# EasyEDA schematic SCH_3.0-CONTROLADORA-PARA-PS2_2024-07-29.json

## Sheets
1 STM32 BLUEPILL copy: TITLE: STM32F103C8T6 BLUEPILL; REV: 1.0; Date: 2021-10-12; Sheet: 1/1; Drawn By: Marlon Vinicius; Company: Your Company
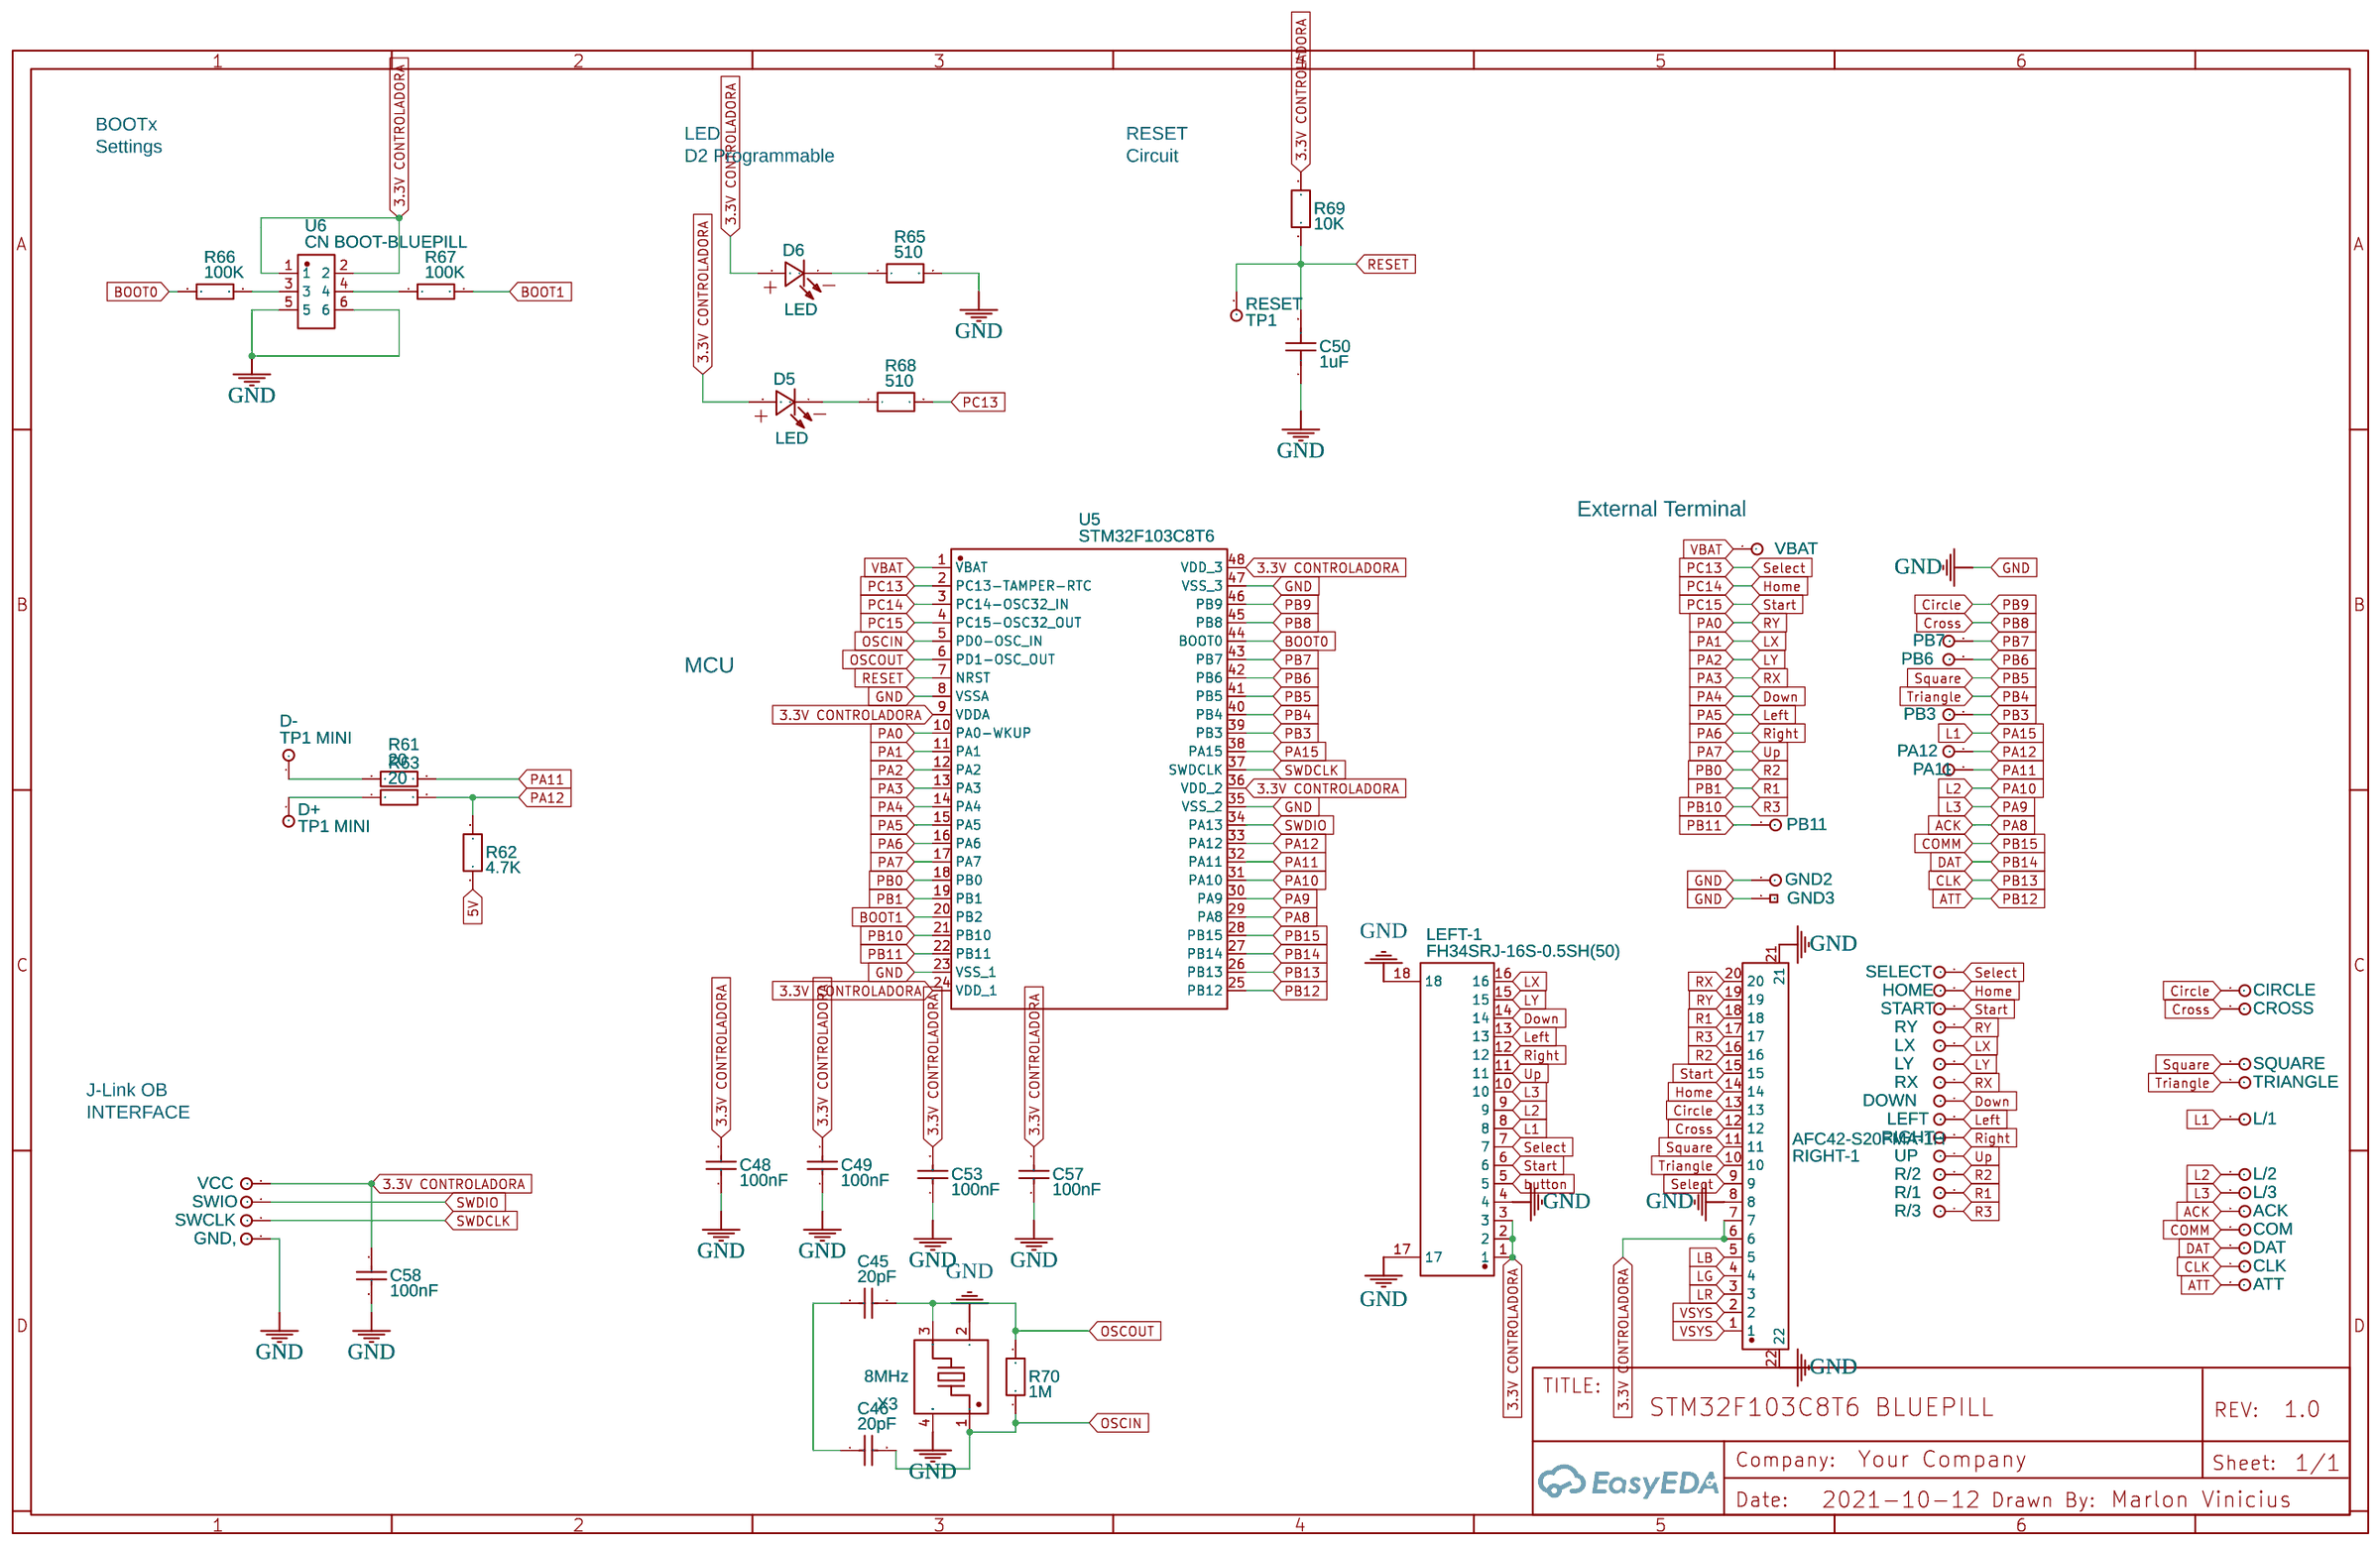
[diagram p0: STM32 BLUEPILL copy]
2 Controladora copy: TITLE: PCB800099; Date: 2021-08-18; Company: PORTABILIZA BR
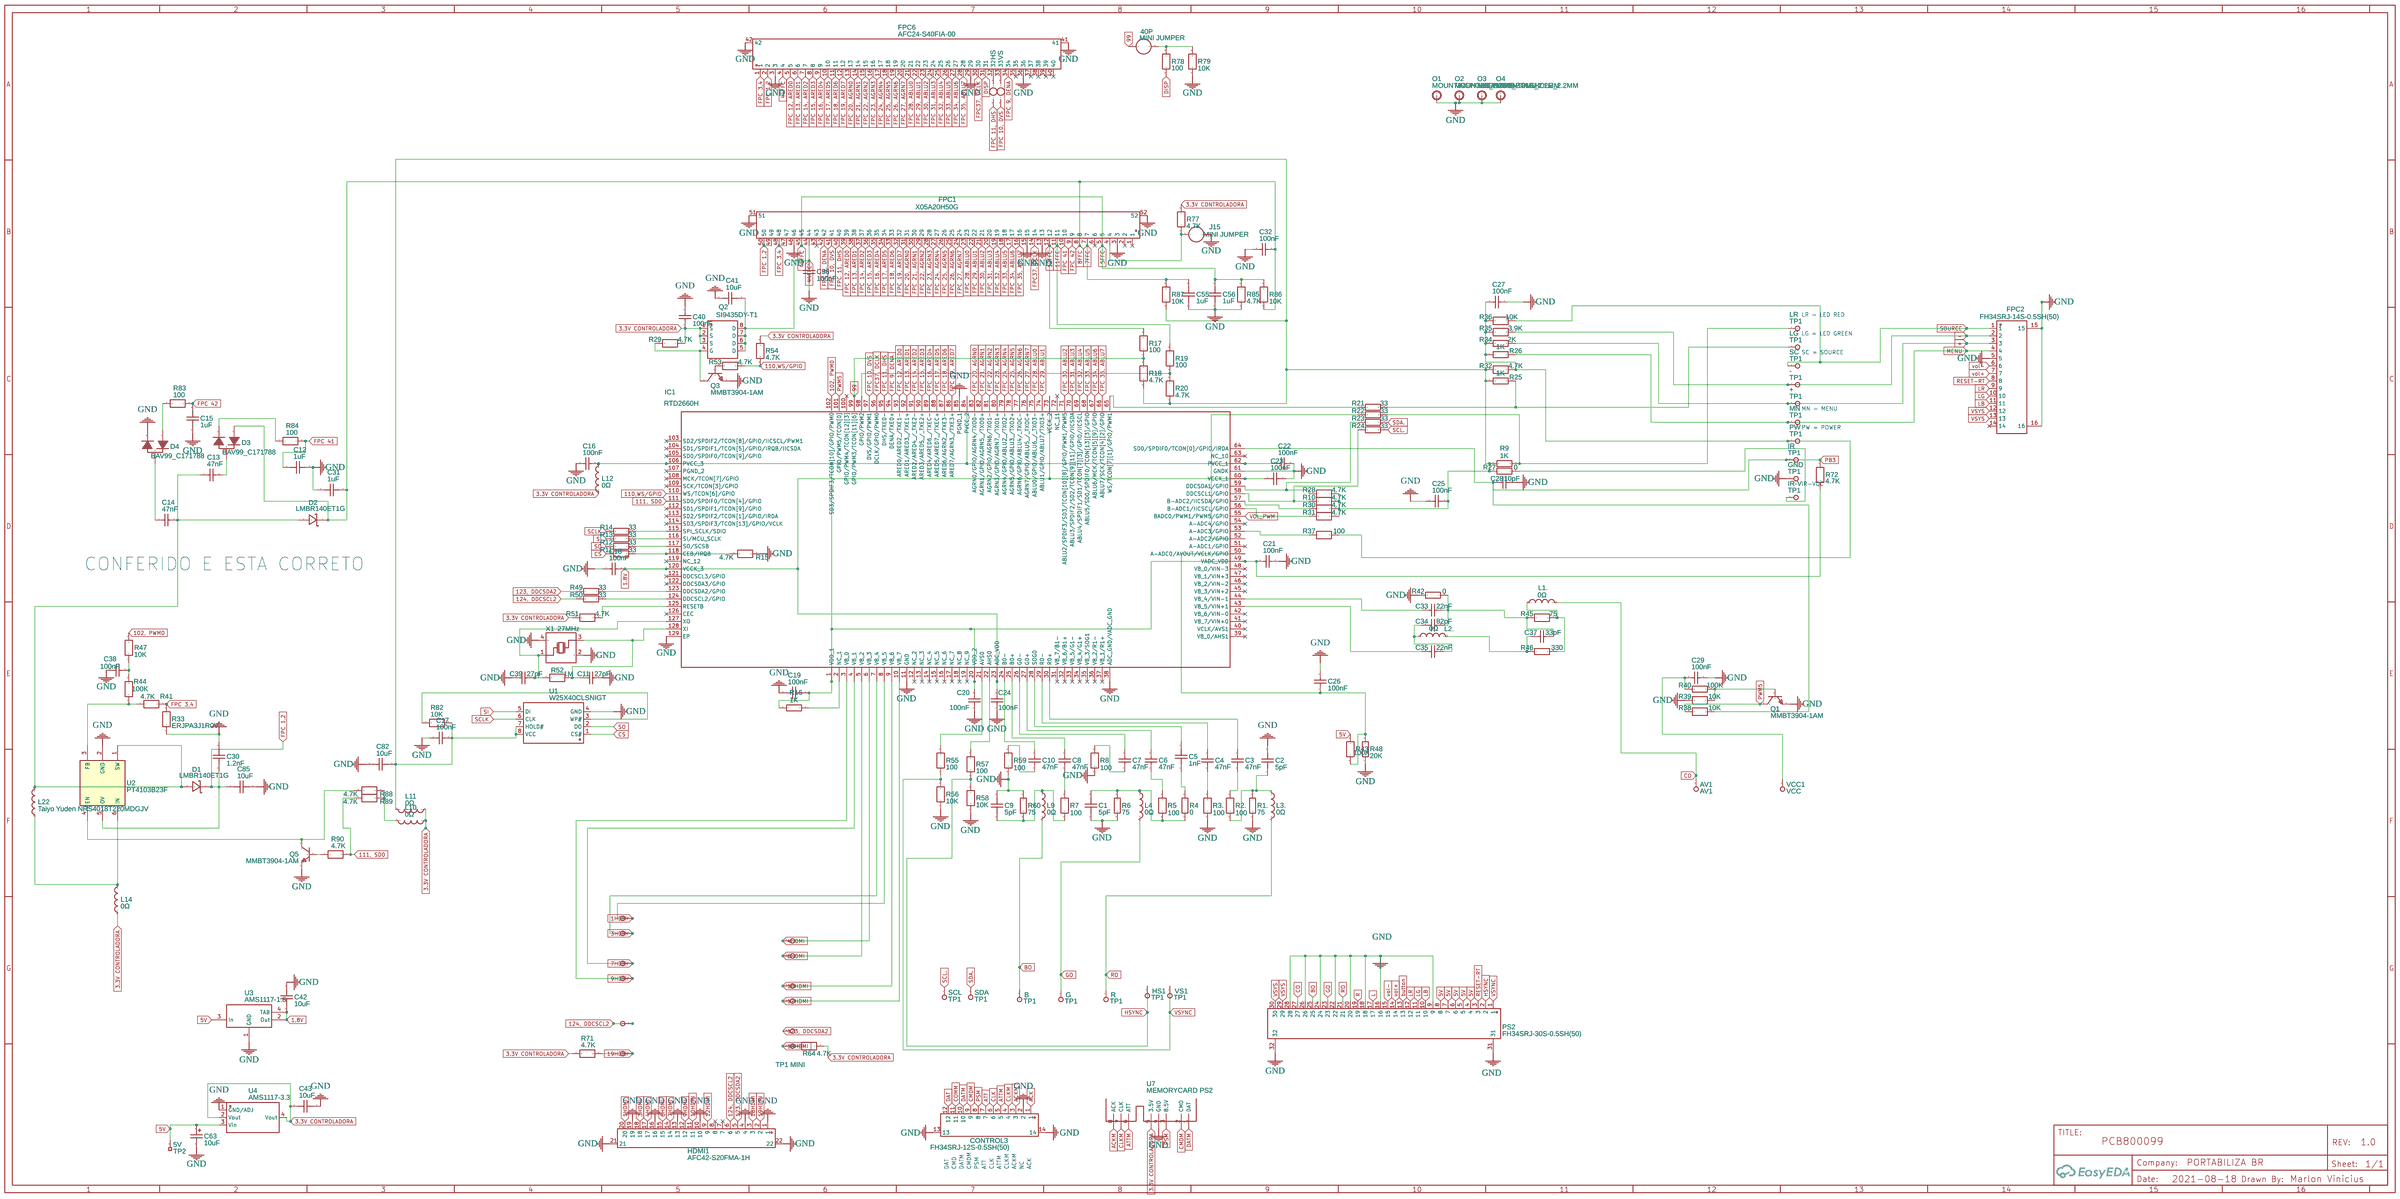
[diagram p1: Controladora copy]
3 AUDIO: TITLE: Sheet_1; Date: 2022-05-21
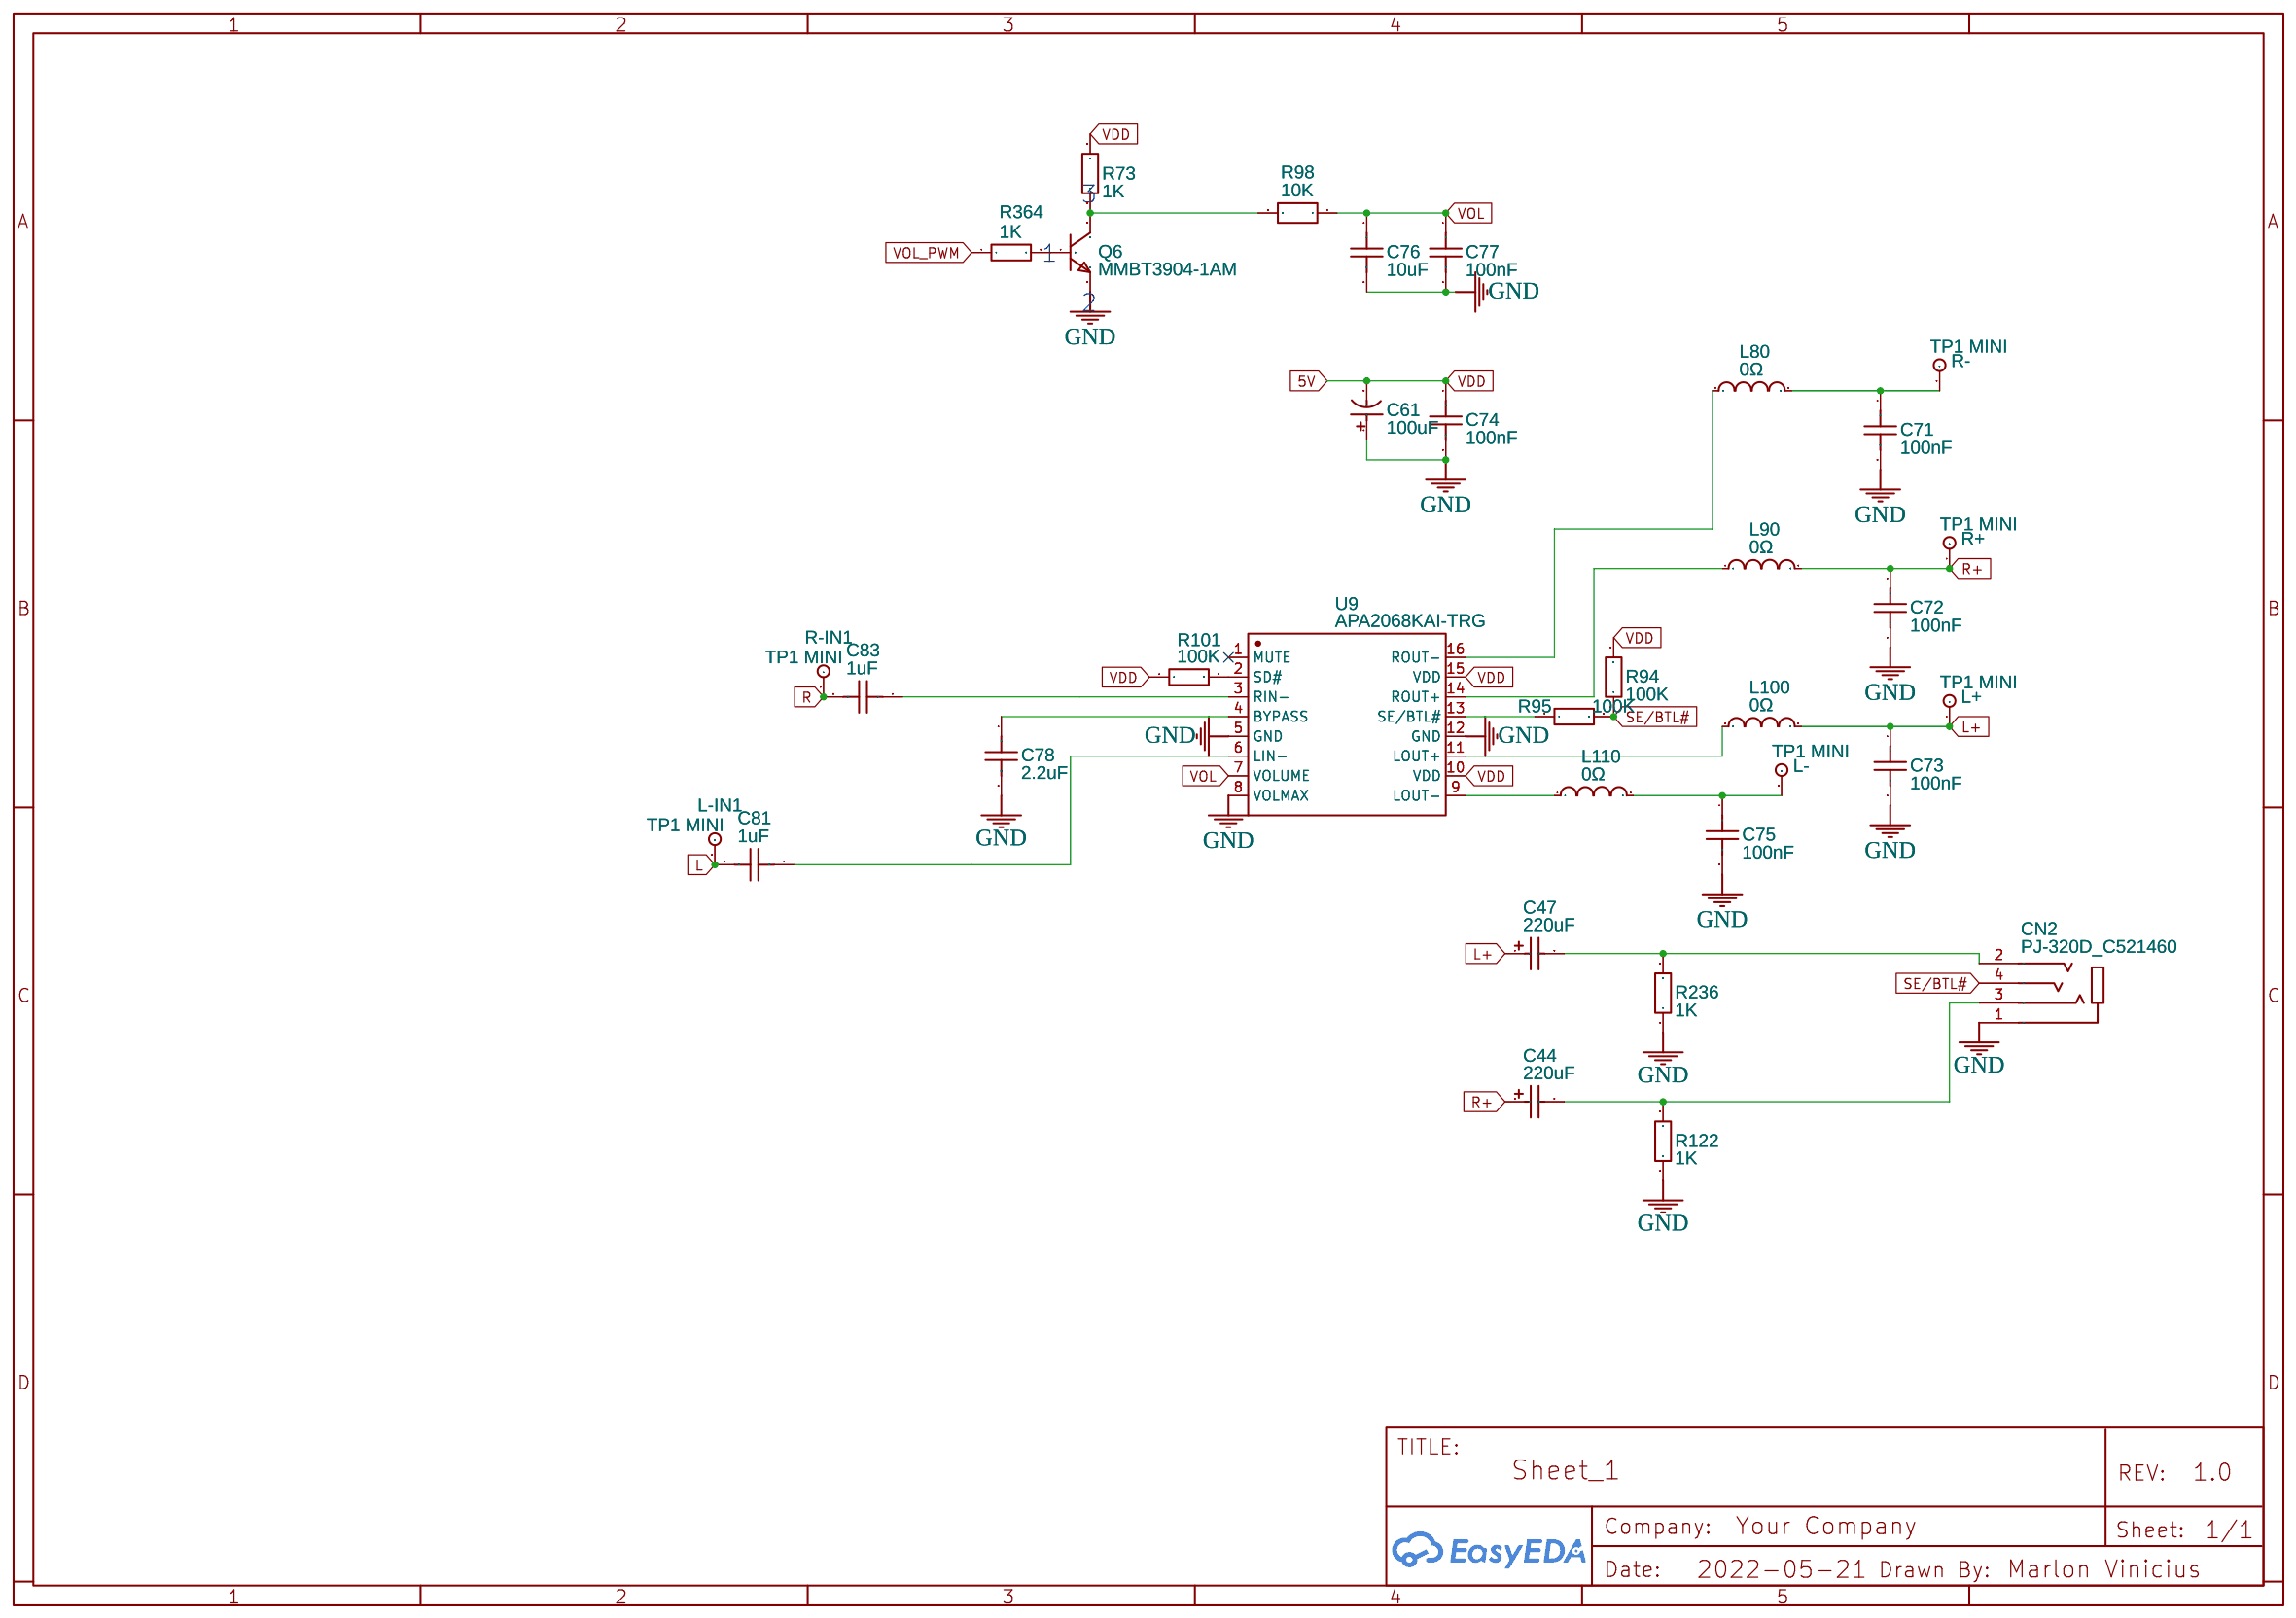
[diagram p2: AUDIO]
4 MEMORYCARD: TITLE: MEMORYCARD; Date: 2023-10-17
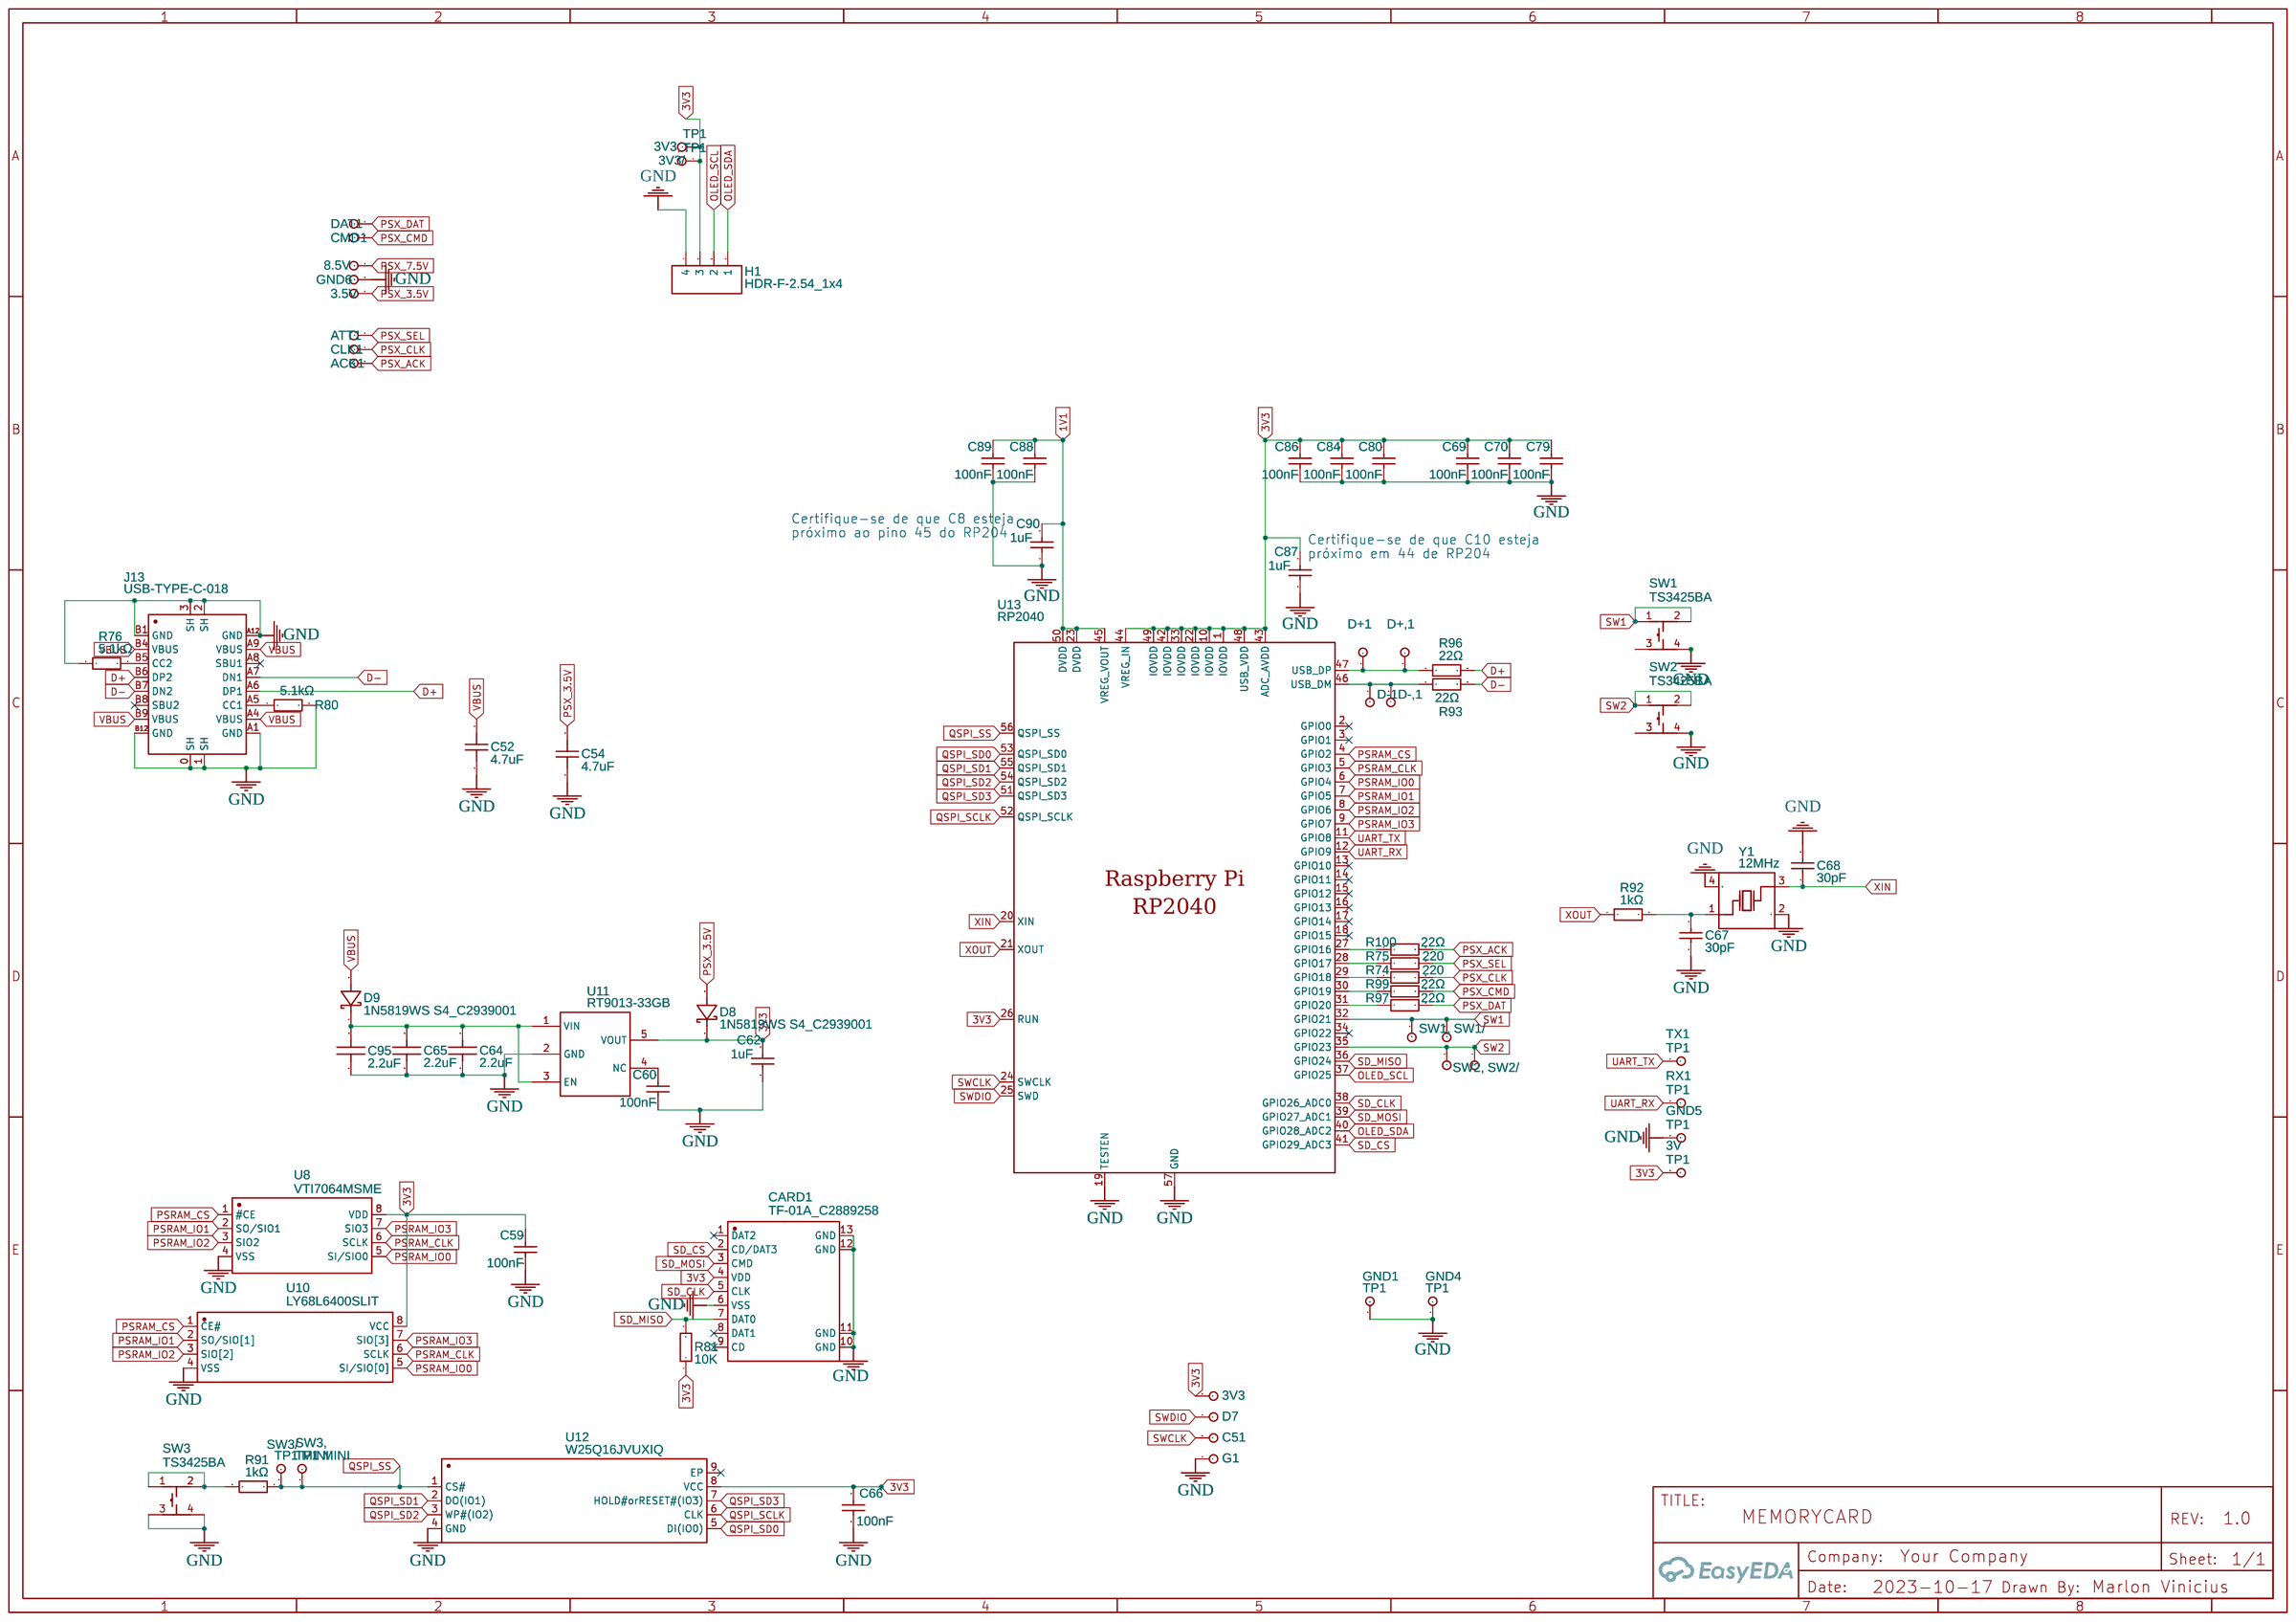
[diagram p3: MEMORYCARD]

## Parts
sheet AUDIO
C44  220uF  [CAP-SMD_L3.5-W2.8-R-RD]
C47  220uF  [CAP-SMD_L3.5-W2.8-R-RD]
C61  100uF  [CAP-SMD_L3.2-W1.6]
C71  100nF  [C0402]
C72  100nF  [C0402]
C73  100nF  [C0402]
C74  100nF  [C0402]
C75  100nF  [C0402]
C76  10uF  [C0603]
C77  100nF  [C0402]
C78  2.2uF  [C0402]
C81  1uF  [C0402]
C83  1uF  [C0402]
CN2  PJ-320D_C521460  [MAUDIO-SMD_PJ-320D]
L80  0Ω  [L0402]
L90  0Ω  [L0402]
L100  0Ω  [L0402]
L110  0Ω  [L0402]
L+  TP1 MINI  [TP1 MINI]
L-  TP1 MINI  [TP1 MINI]
L-IN1  TP1 MINI  [TP1 MINI]
Q6  MMBT3904-1AM  [SOT-23-3_L3.0-W1.7-P0.95-LS2.9-BR]
R73  1K  [R0402]
R94  100K  [R0402]
R95  100K  [R0402]
R98  10K  [R0402]
R101  100K  [R0402]
R122  1K  [R0402]
R236  1K  [R0402]
R364  1K  [R0402]
R+  TP1 MINI  [TP1 MINI]
R-  TP1 MINI  [TP1 MINI]
R-IN1  TP1 MINI  [TP1 MINI]
U9  APA2068KAI-TRG  [SOIC-16_L9.9-W3.9-P1.27-LS6.0-BL]
sheet Controladora copy
5V  TP2  [TP2]
40P  MINI JUMPER  [MINI JUMPER]
+  TP1  [TP1]
-  TP1  [TP1]
AV1  AV1  [TP1]
B  TP1  [TP1]
C1  5pF  [C0402]
C2  5pF  [C0402]
C3  47nF  [C0402]
C4  47nF  [C0402]
C5  1nF  [C0402]
C6  47nF  [C0402]
C7  47nF  [C0402]
C8  47nF  [C0402]
C9  5pF  [C0402]
C10  47nF  [C0402]
C11  27pF  [C0402]
C12  1uF  [C0402]
C13  47nF  [C0402]
C14  47nF  [C0402]
C15  1uF  [C0402]
C16  100nF  [C0402]
C17  100nF  [C0402]
C18  100nF  [C0402]
C19  100nF  [C0402]
C20  100nF  [C0402]
C21  100nF  [C0402]
C22  100nF  [C0402]
C23  100nF  [C0402]
C24  100nF  [C0402]
C25  100nF  [C0402]
C26  100nF  [C0402]
C27  100nF  [C0402]
C28  10pF  [C0402]
C29  100nF  [C0402]
C30  1.2nF  [C0402]
C31  1uF  [C0402]
C32  100nF  [C0402]
C33  22nF  [C0402]
C34  82pF  [C0402]
C35  22nF  [C0402]
C36  100nF  [C0402]
C37  33pF  [C0402]
C38  100nF  [C0402]
C39  27pF  [C0402]
C40  100nF  [C0402]
C41  10uF  [C0603]
C42  10uF  [C0603]
C43  10uF  [C0603]
C55  1uF  [C0402]
C56  1uF  [C0402]
C63  10uF  [CAP-SMD_L3.2-W1.6-R-RD]
C82  10uF  [C0603]
C85  10uF  [C0603]
CONTROL3  FH34SRJ-12S-0.5SH(50)  [FFC-SMD_12P-P0.50_FH34SRJ-12S-0.5SH]
D1  LMBR140ET1G  [SOD-323HE_L2.0-W1.4-LS2.5-RD]
D2  LMBR140ET1G  [SOD-323HE_L2.0-W1.4-LS2.5-RD]
D3  BAV99_C171788  [SOT-23-3_L2.9-W1.3-P1.90-LS2.4-BR]
D4  BAV99_C171788  [SOT-23-3_L2.9-W1.3-P1.90-LS2.4-BR]
FPC1  X05A20H50G  [FPC-SMD_50P-P0.50_X05A20H50G]
FPC2  FH34SRJ-14S-0.5SH(50)  [FFC-SMD_14P-P0.50_FH34SRJ-14S-0.5SH]
FPC6  AFC24-S40FIA-00  [FPC-SMD_P0.50-40P_QCHF-SM-H2.0]
G  TP1  [TP1]
GND  TP1  [TP1]
HDMI1  AFC42-S20FMA-1H  [FFC-SMD_20P-P0.50_AFC42-S20FMA-1H]
HS  MINI JUMPER  [MINI JUMPER]
HS1  TP1  [TP1]
IC1  RTD2660H  [RTD2660H]
IR  TP1  [TP1]
IR-V  TP1  [TP1]
J1  TP1 MINI  [TP1 MINI]
J2  TP1 MINI  [TP1 MINI]
J3  TP1 MINI  [TP1 MINI]
J4  TP1 MINI  [TP1 MINI]
J5  TP1 MINI  [TP1 MINI]
J6  TP1 MINI  [TP1 MINI]
J7  TP1 MINI  [TP1 MINI]
J8  TP1 MINI  [TP1 MINI]
J9  TP1 MINI  [TP1 MINI]
J10  TP1 MINI  [TP1 MINI]
J11  TP1 MINI  [TP1 MINI]
J12  TP1 MINI  [TP1 MINI]
J15  MINI JUMPER  [MINI JUMPER]
L1.  0Ω  [L0402]
L2.  0Ω  [L0402]
L3.  0Ω  [L0402]
L4  0Ω  [L0402]
L9  0Ω  [L0402]
L10  0Ω  [L0603]
L11  0Ω  [L0603]
L12  0Ω  [L0603]
L14  0Ω  [L0603]
L22  Taiyo Yuden NRS4018T220MDGJV  [NRS4018T220MDGJV  4.0X4.0X1.8MM]
LG  TP1  [TP1]
LR  TP1  [TP1]
MN  TP1  [TP1]
O1  MOUNTINGHOLE_2.2MM  [MOUNTINGHOLE_2.2MM_M2_PAD_VIA]
O2  MOUNTINGHOLE_2.2MM  [MOUNTINGHOLE_2.2MM_M2_PAD_VIA]
O3  MOUNTINGHOLE_2.2MM  [MOUNTINGHOLE_2.2MM_M2_PAD_VIA]
O4  MOUNTINGHOLE_2.2MM  [MOUNTINGHOLE_2.2MM_M2_PAD_VIA]
PS2  FH34SRJ-30S-0.5SH(50)  [FFC-SMD_30P-P0.50_FH34SRJ-30S-0.5SH]
PW  TP1  [TP1]
Q1  MMBT3904-1AM  [SOT-23-3_L3.0-W1.7-P0.95-LS2.9-BR]
Q2  SI9435DY-T1  [SO-8_L4.9-W3.9-P1.27-LS5.9-BL]
Q3  MMBT3904-1AM  [SOT-23-3_L3.0-W1.7-P0.95-LS2.9-BR]
Q5  MMBT3904-1AM  [SOT-23-3_L3.0-W1.7-P0.95-LS2.9-BR]
R  TP1  [TP1]
R1.  75  [R0402]
R2.  100  [R0402]
R3.  100  [R0402]
R4  0  [R0402]
R5  100  [R0402]
R6  75  [R0402]
R7  100  [R0402]
R8  100  [R0402]
R9  1K  [R0402]
R10  4.7K  [R0402]
R11  33  [R0402]
R12  33  [R0402]
R13  33  [R0402]
R14  33  [R0402]
R15  4.7K  [R0402]
R16  1K  [R0402]
R17  100  [R0402]
R18  4.7K  [R0402]
R19  100  [R0402]
R20  4.7K  [R0402]
R21  33  [R0402]
R22  33  [R0402]
R23  33  [R0402]
R24  33  [R0402]
R25  1K  [R0402]
R26  1K  [R0402]
R27  0  [R0402]
R28  4.7K  [R0402]
R29  4.7K  [R0402]
R30  4.7K  [R0402]
R31  4.7K  [R0402]
R32  4.7K  [R0402]
R33  ERJPA3J1R0V  [R0603]
R34  2K  [R0402]
R35  3.9K  [R0402]
R36  10K  [R0402]
R37  100  [R0402]
R38  10K  [R0402]
R39  10K  [R0402]
R40  100K  [R0402]
R41  4.7K  [R0402]
R42  0  [R0402]
R43  100K  [R0402]
R44  100K  [R0402]
R45  75  [R0402]
R46  330  [R0402]
R47  10K  [R0402]
R48  20K  [R0402]
R49  33  [R0402]
R50  33  [R0402]
R51  4.7K  [R0402]
R52  1M  [R0402]
R53  4.7K  [R0402]
R54  4.7K  [R0402]
R55  100  [R0402]
R56  10K  [R0402]
R57  100  [R0402]
R58  10K  [R0402]
R59  100  [R0402]
R60  75  [R0402]
R64  4.7K  [R0402]
R71  4.7K  [R0402]
R72  4.7K  [R0402]
R77  4.7K  [R0402]
R78  100  [R0402]
R79  10K  [R0402]
R82  10K  [R0402]
R83  100  [R0402]
R84  100  [R0402]
R85  4.7K  [R0402]
R86  10K  [R0402]
R87  10K  [R0402]
R88  4.7K  [R0402]
R89  4.7K  [R0402]
R90  4.7K  [R0402]
SC  TP1  [TP1]
SCL  TP1  [TP1]
SDA  TP1  [TP1]
U1  W25X40CLSNIGT  [SOIC-8_L5.0-W4.0-P1.27-LS6.0-BL]
U2  PT4103B23F  [SOT-23-6_L2.9-W1.6-P0.95-LS2.8-BR]
U3  AMS1117-1.8  [SOT-223-4_L6.5-W3.5-P2.30-LS7.0-BR]
U4  AMS1117-3.3  [SOT-223-3_L6.5-W3.4-P2.30-LS7.0-BR]
U7  MEMORYCARD PS2  [MEMORYCARD PS2]
VCC1  VCC  [TP1]
VS  MINI JUMPER  [MINI JUMPER]
VS1  TP1  [TP1]
X1  27MHz  [OSC-SMD_4P-L3.2-W2.5-BL]
sheet MEMORYCARD
3.5V  TP1 MINI  [TP1 MINI]
3V  TP1  [TP1]
3V3  TP1 MINI  [TP1 MINI]
3V3,  TP1  [TP1]
3V3/  TP1  [TP1]
8.5V  TP1 MINI  [TP1 MINI]
ACK1  TP1 MINI  [TP1 MINI]
ATT1  TP1 MINI  [TP1 MINI]
C51  TP1 MINI  [TP1 MINI]
C52  4.7uF  [C0402]
C54  4.7uF  [C0402]
C59  100nF  [C0402_NEW]
C60  100nF  [C0402_NEW]
C62  1uF  [C0402]
C64  2.2uF  [C0402]
C65  2.2uF  [C0402]
C66  100nF  [C0402_NEW]
C67  30pF  [C0402]
C68  30pF  [C0402]
C69  100nF  [C0402_NEW]
C70  100nF  [C0402_NEW]
C79  100nF  [C0402_NEW]
C80  100nF  [C0402_NEW]
C84  100nF  [C0402_NEW]
C86  100nF  [C0402_NEW]
C87  1uF  [C0402]
C88  100nF  [C0402_NEW]
C89  100nF  [C0402_NEW]
C90  1uF  [C0402]
C95  2.2uF  [C0402]
CARD1  TF-01A_C2889258  [TF-SMD_TF-02]
CLK1  TP1 MINI  [TP1 MINI]
CMD1  TP1 MINI  [TP1 MINI]
D7  SWDIO  [TP1 MINI]
D8  1N5819WS S4_C2939001  [SOD-323_L1.7-W1.3-LS2.6-RD-1]
D9  1N5819WS S4_C2939001  [SOD-323_L1.7-W1.3-LS2.6-RD-1]
D+1  NO  [TP1 MINI]
D+,1  NO  [TP1 MINI]
D-1  NO  [TP1 MINI]
D-,1  NO  [TP1 MINI]
DAT1  TP1 MINI  [TP1 MINI]
G1  TP1 MINI  [TP1 MINI]
GND1  TP1  [TP1]
GND4  TP1  [TP1]
GND5  TP1  [TP1]
GND6  TP1 MINI  [TP1 MINI]
H1  HDR-F-2.54_1x4  [HDR-F-2.54_1X4]
J13  USB-TYPE-C-018  [USB-C_SMD-TYPE-C-31-M-12]
R74  220  [R0402]
R75  220  [R0402]
R76  5.1kΩ  [R0402]
R80  5.1kΩ  [R0402]
R81  10K  [R0402]
R91  1kΩ  [R0402]
R92  1kΩ  [R0402]
R93  22Ω  [R0402]
R96  22Ω  [R0402]
R97  22Ω  [R0402]
R99  22Ω  [R0402]
R100  22Ω  [R0402]
RX1  TP1  [TP1]
SW1  TS3425BA  [SW-SMD_4P-L4.2-W3.2-P2.15-LS4.6-1]
SW1,  NO  [TP1 MINI]
SW1/  NO  [TP1 MINI]
SW2  TS3425BA  [SW-SMD_4P-L4.2-W3.2-P2.15-LS4.6-1]
SW2,  NO  [TP1 MINI]
SW2/  NO  [TP1 MINI]
SW3  TS3425BA  [SW-SMD_4P-L4.2-W3.2-P2.15-LS4.6-1]
SW3,  TP1 MINI  [TP1 MINI]
SW3/  TP1 MINI  [TP1 MINI]
TX1  TP1  [TP1]
U8  VTI7064MSME  [SOIC-8_L4.9-W3.9-P1.27-LS6.0-BL]
U10  LY68L6400SLIT  [SOP-8_L4.9-W3.9-P1.27-LS6.0-BL]
U11  RT9013-33GB  [SOT-23-5_L3.0-W1.7-P0.95-LS2.8-BL]
U12  W25Q16JVUXIQ  [USON-8_L3.0-W2.0-P0.50-BL-EP]
U13  RP2040  [LQFN-56_L7.0-W7.0-P0.4-EP]
Y1  12MHz  [OSC-SMD_4P-L3.2-W2.5-BL]
sheet STM32 BLUEPILL copy
ACK  TP1 MINI  [TP1 MINI]
ATT  TP1 MINI  [TP1 MINI]
C45  20pF  [C0402]
C46  20pF  [C0402]
C48  100nF  [C0402]
C49  100nF  [C0402]
C50  1uF  [C0402]
C53  100nF  [C0402]
C57  100nF  [C0402]
C58  100nF  [C0402]
CIRCLE  TP1 MINI  [TP1 MINI]
CLK  TP1 MINI  [TP1 MINI]
COM  TP1 MINI  [TP1 MINI]
CROSS  TP1 MINI  [TP1 MINI]
D5  LED  [LED-SMD_L2.0-W0.5-RD]
D6  LED  [LED-SMD_L2.0-W0.5-RD]
D+  TP1 MINI  [TP1 MINI]
D-  TP1 MINI  [TP1 MINI]
DAT  TP1 MINI  [TP1 MINI]
DOWN  TP1 MINI  [TP1 MINI]
GND2  TP1  [TP1]
GND3  TP2  [TP2]
GND,  TP1  [TP1]
HOME  TP1 MINI  [TP1 MINI]
L/1  TP1 MINI  [TP1 MINI]
L/2  TP1 MINI  [TP1 MINI]
L/3  TP1 MINI  [TP1 MINI]
LEFT  TP1 MINI  [TP1 MINI]
LEFT-1  FH34SRJ-16S-0.5SH(50)  [FFC-SMD_16P-P0.50_FH34SRJ-16S-0.5SH]
LX  TP1 MINI  [TP1 MINI]
LY  TP1 MINI  [TP1 MINI]
PA11  TP1 MINI  [TP1 MINI]
PA12  TP1 MINI  [TP1 MINI]
PB3  TP1 MINI  [TP1 MINI]
PB6  TP1 MINI  [TP1 MINI]
PB7  TP1 MINI  [TP1 MINI]
PB11  TP1 MINI  [TP1 MINI]
R61  20  [R0402]
R62  4.7K  [R0402]
R63  20  [R0402]
R65  510  [R0402]
R66  100K  [R0402]
R67  100K  [R0402]
R68  510  [R0402]
R69  10K  [R0402]
R70  1M  [R0402]
R/1  TP1 MINI  [TP1 MINI]
R/2  TP1 MINI  [TP1 MINI]
R/3  TP1 MINI  [TP1 MINI]
RESET  TP1  [TP1]
RIGHT  TP1 MINI  [TP1 MINI]
RIGHT-1  AFC42-S20FMA-1H  [FFC-SMD_20P-P0.50_AFC42-S20FMA-1H]
RX  TP1 MINI  [TP1 MINI]
RY  TP1 MINI  [TP1 MINI]
SELECT  TP1 MINI  [TP1 MINI]
SQUARE  TP1 MINI  [TP1 MINI]
START  TP1 MINI  [TP1 MINI]
SWCLK  TP1  [TP1]
SWIO  TP1  [TP1]
TRIANGLE  TP1 MINI  [TP1 MINI]
U5  STM32F103C8T6  [LQFP-48_L7.0-W7.0-P0.50-LS9.0-BL]
U6  CN BOOT-BLUEPILL  [BOOT-BLUEPILL]
UP  TP1 MINI  [TP1 MINI]
VBAT  TP1 MINI  [TP1 MINI]
VCC  TP1  [TP1]
X3  8MHz  [OSC-SMD_4P-L3.2-W2.5-BL]

## Library data of the parts
C44 C47 = TLJB227M006R0500: Supplier: LCSC; Manufacturer: AVX; Supplier Part: C30242; JLCPCB Part Class: Extended Part
C61 = CA45-A6R3K107T: Supplier: LCSC; Supplier Part: C435293; Manufacturer: Hunan Xiangyee in S&T; Contributor: LCSC; JLCPCB Part Class: Extended Part
C19 C71-C75 C77 = CC0402JRX7R6BB104: Supplier: LCSC; Supplier Part: C527001; Manufacturer: YAGEO; Contributor: LCSC
C76 = CL10A106KP8NNNC: Supplier: LCSC; Manufacturer: SAMSUNG; Supplier Part: C19702; JLCPCB Part Class: Basic Part
C78 = CL05A225KQ5NSNC: Supplier: LCSC; Supplier Part: C307419; Manufacturer: Samsung Electro-Mechanics; Contributor: LCSC; JLCPCB Part Class: Extended Part
C12 C15 C31 C50 C55 C56 C81 C83 = CL05A105KA5NQNC: Supplier: LCSC; Manufacturer: SAMSUNG; Supplier Part: C52923; JLCPCB Part Class: Basic Part
CN2 = PJ-320D_C521460: Supplier: LCSC; Supplier Part: C521460; Manufacturer: USAKRO; Manufacturer Part: PJ-320D; Contributor: LCSC; JLCPCB Part Class: Extended Part
L1. L2. L3. L4 L9 L80 L90 L100 L110 = CBG100505U000T: Supplier: LCSC; Manufacturer: FH; Supplier Part: C139137; JLCPCB Part Class: Extended Part
3.5V 3V3 8.5V ACK ACK1 ATT ATT1 C51 CIRCLE CLK CLK1 CMD1 COM CROSS D7 D+ D+1 D+,1 D- D-1 D-,1 DAT DAT1 DOWN G1 GND6 HOME J1-J12 L+ L- L-IN1 L/1-L/3 LEFT LX LY PA11 PA12 PB3 PB6 PB7 PB11 R+ R- R-IN1 R/1-R/3 RIGHT RX RY SELECT SQUARE START SW1, SW1/ SW2, SW2/ SW3, SW3/ TRIANGLE UP VBAT = TP1 MINI: Contributor: Marlon Vinicius
Q1 Q3 Q5 Q6 = MMBT3904-1AM: Supplier: LCSC; Supplier Part: C364310; Manufacturer: (MDD) Jiangsu Yutai Elec; Contributor: LCSC; LCSC Assembly: Yes; SMT Type: Extend
R9 R16 R25 R26 R73 R122 R236 R364 = AC0402FR-071KL: Supplier: LCSC; Manufacturer: YAGEO; Contributor: LCSC; Supplier Part: C144789; JLCPCB Part Class: Extended Part; Resistance: 1kΩ
R40 R66 R67 R94 R95 R101 = RC0402FR-07100KL: Supplier: LCSC; Manufacturer: YAGEO; Supplier Part: C60491; JLCPCB Part Class: Extended Part
R36 R38 R39 R56 R69 R79 R82 R86 R87 R98 = ERJPA2F1002X: Supplier: LCSC; Supplier Part: C427247; Manufacturer: PANASONIC; Contributor: LCSC
U9 = APA2068KAI-TRG: Supplier: LCSC; Manufacturer: ANPEC; Supplier Part: C11147; JLCPCB Part Class: Extended Part
5V GND3 = TP2: Contributor: Marlon Vinicius
40P HS J15 VS = MINI JUMPER: Contributor: Marlon Vinicius
+ - AV1 B G GND GND2 GND, HS1 IR IR-V LG LR MN PW R RESET SC SCL SDA SWCLK SWIO VCC VCC1 VS1 = TP1: Contributor: Marlon Vinicius
C1 C2 C9 = CC0402CRNPO9BN5R0: Supplier: LCSC; Supplier Part: C130117; Manufacturer: YAGEO; Contributor: LCSC; JLCPCB Part Class: Extended Part
C3 C4 C6-C8 C10 = GRM155R71C473KA01D: Supplier: LCSC; Manufacturer: MuRata; Supplier Part: C77012
C5 = CC0402JRNPO8BN102: Supplier: LCSC; Supplier Part: C526995; Manufacturer: YAGEO; Contributor: LCSC
C11 C39 = GCM1555C1H270JA16D: Supplier: LCSC; Manufacturer: MuRata; Supplier Part: C126504; JLCPCB Part Class: Extended Part
C13 C14 = CC0402KRX7R8BB473: Supplier: LCSC; Manufacturer: YAGEO; Supplier Part: C107020; Paste Type: Extended Part; JLCPCB Part Class: Extended Part
C16-C18 C20-C27 C29 C32 C36 C38 C40 C48 C49 C53 C57 C58 = CC0402KRX7R8BB104: Supplier: LCSC; Manufacturer: YAGEO; Contributor: LCSC; Supplier Part: C105883; JLCPCB Part Class: Extended Part
C28 = CC0402JRNPO9BN100: Supplier: LCSC; Manufacturer: YAGEO; Supplier Part: C106199; JLCPCB Part Class: Extended Part
C30 = 0402B122M500CT: Supplier: LCSC; Supplier Part: C295921; Manufacturer: Huaxin S&T; Contributor: LCSC
C33 C35 = CC0402KRX7R9BB223: Supplier: LCSC; Manufacturer: YAGEO; Supplier Part: C107026; JLCPCB Part Class: Extended Part
C34 = CC0402JRNPO9BN820: Supplier: LCSC; Manufacturer: YAGEO; Supplier Part: C107011; JLCPCB Part Class: Extended Part
C37 = CL05C330JB5NNNC: Supplier: LCSC; Manufacturer: SAMSUNG; Supplier Part: C70465; JLCPCB Part Class: Extended Part
C41-C43 C82 C85 = CL10A106MA8NRNC: Supplier: LCSC; Manufacturer: SAMSUNG; Supplier Part: C96446; JLCPCB Part Class: Extended Part
C63 = TAJA106K010RNJ: Supplier: LCSC; Manufacturer: AVX; Supplier Part: C7177; JLCPCB Part Class: Extended Part
CONTROL3 = FH34SRJ-12S-0.5SH(50): Supplier: LCSC; Supplier Part: C424659; Manufacturer: Hirose; Contributor: LCSC; JLCPCB Part Class: Extended Part
D1 D2 = LMBR140ET1G: Supplier: LCSC; Supplier Part: C172430; Manufacturer: Leshan Radio; Contributor: LCSC; JLCPCB Part Class: Extended Part
D3 D4 = BAV99_C171788: Supplier: LCSC; Supplier Part: C171788; Manufacturer: Sangdest Microelectronicstronic (Nanjing); Manufacturer Part: BAV99; Contributor: LCSC; LCSC Assembly: Yes; SMT Type: Extend
FPC1 = X05A20H50G: Supplier: LCSC; Supplier Part: C397332; Manufacturer: XKB Enterprise; Contributor: LCSC; JLCPCB Part Class: Extended Part
FPC2 = FH34SRJ-14S-0.5SH(50): Supplier: LCSC; Supplier Part: C324724; Manufacturer: Hirose; Contributor: LCSC; JLCPCB Part Class: Extended Part
FPC6 = AFC24-S40FIA-00: Supplier: LCSC; Supplier Part: C262686; Manufacturer: JUSHUO; Contributor: LCSC; JLCPCB Part Class: Extended Part
HDMI1 RIGHT-1 = AFC42-S20FMA-1H: Supplier: LCSC; Supplier Part: C466534; Manufacturer: JUSHUO; Contributor: LCSC; JLCPCB Part Class: Extended Part
IC1 = RTD2660H: Contributor: Marlon Vinicius
L10-L12 L14 = CBW160808U000T: Supplier: LCSC; Manufacturer: FH; Supplier Part: C139173; Paste Type: Extended Part; JLCPCB Part Class: Extended Part
L22 = Taiyo Yuden NRS4018T220MDGJV: Manufacturer: Taiyo Yuden; Manufacturer Part: NRS4018T220MDGJV; Supplier: LCSC; Supplier Part: C2041551; link: https://www.lcsc.com/product-detail/Inductors-SMD_Taiyo-Yuden-NRS4018T220MDGJV_C2041551.html; Contributor: Marlon Vinicius
O1-O4 = MOUNTINGHOLE_2.2MM: Contributor: Marlon Vinicius
PS2 = FH34SRJ-30S-0.5SH(50): Supplier: LCSC; Supplier Part: C324727; Manufacturer: Hirose; Contributor: LCSC; JLCPCB Part Class: Extended Part
Q2 = SI9435DY-T1: Supplier: LCSC; Supplier Part: C693353; Manufacturer: VBsemi Elec; Contributor: LCSC; JLCPCB Part Class: Extended Part
R1. R6 R60 = RC0402JR-0775RL: Supplier: LCSC; Manufacturer: YAGEO; Supplier Part: C137841; JLCPCB Part Class: Extended Part
R2. R3. R5 R7 R8 R17 R19 R37 R55 R57 R59 R78 R83 R84 = ERJPA2J101X: Supplier: LCSC; Supplier Part: C427204; Manufacturer: PANASONIC; Contributor: LCSC
R4 R27 R42 = RC0402FR-070RL: Supplier: LCSC; Manufacturer: YAGEO; Supplier Part: C106231; JLCPCB Part Class: Extended Part
R10 R15 R18 R20 R28-R32 R41 R51 R53 R54 R62 R64 R71 R72 R77 R85 R88-R90 = ERJPA2F4701X: Supplier: LCSC; Supplier Part: C427244; Manufacturer: PANASONIC; Contributor: LCSC
R11-R14 R21-R24 R49 R50 = ERJ2RKF33R0X: Supplier: LCSC; Supplier Part: C278594; Manufacturer: PANASONIC; Contributor: LCSC
R33 = ERJPA3J1R0V: Supplier: LCSC; Supplier Part: C445774; Manufacturer: PANASONIC; Contributor: LCSC
R34 = RC0402FR-072KL: Supplier: LCSC; Manufacturer: YAGEO; Supplier Part: C60488
R35 = ERJ2RKF3901X: Supplier: LCSC; Supplier Part: C413091; Manufacturer: PANASONIC; Contributor: LCSC
R43 R44 = ERJPA2J104X: Supplier: LCSC; Supplier Part: C427222; Manufacturer: PANASONIC; Contributor: LCSC
R45 = ERJ2RKF75R0X: Supplier: LCSC; Supplier Part: C413061; Manufacturer: PANASONIC; Contributor: LCSC
R46 = 0402WGF3300TCE: Supplier: LCSC; Manufacturer: UniOhm; Supplier Part: C25104; JLCPCB Part Class: Basic Part
R47 R58 = ERJPA2F1002X: Supplier: LCSC; Supplier Part: C427247C427247; Manufacturer: PANASONIC; Contributor: LCSC
R48 = RC0402JR-0720KL: Supplier: LCSC; Manufacturer: YAGEO; Contributor: LCSC; Supplier Part: C137902; JLCPCB Part Class: Extended Part
R52 R70 = ERJPA2J105X: Supplier: LCSC; Supplier Part: C427228; Manufacturer: PANASONIC; Contributor: LCSC
U1 = W25X40CLSNIGT: Supplier: LCSC; Manufacturer: WINBOND; Supplier Part: C113674; JLCPCB Part Class: Extended Part
U2 = PT4103B23F: Supplier: LCSC; Manufacturer: PowTech; Supplier Part: C19861; JLCPCB Part Class: Extended Part
U3 = AMS1117-1.8: Supplier: LCSC; Manufacturer: AMS; Supplier Part: C6185; JLCPCB Part Class: Extended Part
U4 = AMS1117-3.3: sourceId: dwIGgezVh; Supplier: LCSC; Manufacturer: AMS; Supplier Part: C6186; JLCPCB Part Class: Basic Part
U7 = MEMORYCARD PS2: Contributor: linkmarlonvrb
X1 = X322527MSB4SI: Supplier: LCSC; Manufacturer: YXC; Supplier Part: C9008; Paste Type: Extended Part; JLCPCB Part Class: Extended Part
3V 3V3, 3V3/ GND1 GND4 GND5 RX1 TX1 = TP1: Contributor: Marlon Vinicius; Convert to PCB: Yes; Add into BOM: Yes
C52 C54 = CL05A475KP5NRNC: Supplier: LCSC; Supplier Part: C368809; Manufacturer: Samsung Electro-Mechanics; Contributor: LCSC; JLCPCB Part Class: Extended Part
C59 C60 C66 C69 C70 C79 C80 C84 C86 C88 C89 = CL05B104KO5NNNC: Supplier: LCSC; Manufacturer: SAMSUNG; Supplier Part: C1525; JLCPCB Part Class: Basic Part
C62 C87 C90 = CL05A105KO5NNNC: Supplier: LCSC; Manufacturer: SAMSUNG; Supplier Part: C29266; JLCPCB Part Class: Extended Part
C64 C65 C95 = CL05A225MQ5NSNC: Supplier: LCSC; Manufacturer: SAMSUNG; Supplier Part: C12530; JLCPCB Part Class: Basic Part
C67 C68 = CC0402JRNPO9BN300: Supplier: LCSC; Manufacturer: YAGEO(国巨); Supplier Part: C107004; JLCPCB Part Class: Extended Part; link: https://lcsc.com/eda_search?q=C107004&%26type=1&ref=editor
CARD1 = TF-01A_C2889258: Contributor: LCSC; Supplier: LCSC; Supplier Part: C2889258; Manufacturer: Yuandi(台湾元迪); Manufacturer Part: TF-01A; JLCPCB Part Class: Extended Part; link: https://lcsc.com/eda_search?q=C2889258&%26type=1&ref=editor
D8 D9 = 1N5819WS S4_C2939001: Contributor: lcsc; Supplier: LCSC; Supplier Part: C2939001; Manufacturer: KUU; Manufacturer Part: 1N5819WS S4; JLCPCB Part Class: Extended Part; link: https://lcsc.com/eda_search?q=C2939001&%26type=1&ref=editor
H1 = HDR-F-2.54_1x4: Supplier Part: C225501; Supplier: LCSC; Contributor: LCEDA_Lib
J13 = USB-TYPE-C-018: Contributor: LCSC; Supplier: LCSC; Supplier Part: C2927038; Manufacturer: DEALON(德艺隆); JLCPCB Part Class: Extended Part; link: https://lcsc.com/eda_search?q=C2927038&%26type=1&ref=editor
R74 R75 = 0402WGJ0221TCE: Supplier: LCSC; Manufacturer: UniOhm; Supplier Part: C25151; JLCPCB Part Class: Extended Part
R76 R80 = 0402WGF5101TCE: Supplier: LCSC; Manufacturer: UNI-ROYAL(厚声); Supplier Part: C25905; JLCPCB Part Class: Basic Part; link: https://lcsc.com/eda_search?q=C25905&%26type=1&ref=editor
R81 = 0402WGF1002TCE: Supplier: LCSC; Manufacturer: UniOhm; Supplier Part: C25744; JLCPCB Part Class: Basic Part
R91 R92 = RC0402FR-071KL: Supplier: LCSC; Manufacturer: YAGEO(国巨); Supplier Part: C106235; JLCPCB Part Class: Extended Part; link: https://lcsc.com/eda_search?q=C106235&%26type=1&ref=editor
R93 R96 R97 R99 R100 = RC0402JR-0722RL: Supplier: LCSC; Manufacturer: YAGEO(国巨); Supplier Part: C93929; JLCPCB Part Class: Extended Part; link: https://lcsc.com/eda_search?q=C93929&%26type=1&ref=editor
SW1-SW3 = TS3425BA: Contributor: LCSC; Supplier: LCSC; Supplier Part: C2681476; Manufacturer: SHOU HAN(首韩); JLCPCB Part Class: Extended Part; link: https://lcsc.com/eda_search?q=C2681476&%26type=1&ref=editor
U8 = VTI7064MSME: Contributor: LCSC; Supplier: LCSC; Manufacturer: Vilsion; Supplier Part: C139966; JLCPCB Part Class: Extended Part; link: https://lcsc.com/eda_search?q=C139966&%26type=1&ref=editor
U10 = LY68L6400SLIT: Contributor: LCSC; Supplier: LCSC; Supplier Part: C261881; Manufacturer: Lyontek(来扬); JLCPCB Part Class: Extended Part; link: https://lcsc.com/eda_search?q=C261881&%26type=1&ref=editor
U11 = RT9013-33GB: Supplier: LCSC; Manufacturer: RICHTEK(立锜); Supplier Part: C47773; JLCPCB Part Class: Extended Part; link: https://lcsc.com/eda_search?q=C47773&%26type=1&ref=editor
U12 = W25Q16JVUXIQ: Contributor: lcsc; Supplier: LCSC; Supplier Part: C2843335; Manufacturer: WINBOND(华邦); JLCPCB Part Class: Extended Part; link: https://lcsc.com/eda_search?q=C2843335&%26type=1&ref=editor
U13 = RP2040: Contributor: LCSC; Supplier: LCSC; Supplier Part: C2040; Manufacturer: Raspberry Pi(树莓派); JLCPCB Part Class: Extended Part; link: https://lcsc.com/eda_search?q=C2040&%26type=1&ref=editor
Y1 = SMD-3225_4P12MHZ10PF10PPM-40&#126;+85℃: Contributor: LCSC; Supplier: LCSC; Supplier Part: C164041; Manufacturer: TAE(雅晶鑫); Manufacturer Part: TAXM12M4RDBCCT2T; JLCPCB Part Class: Extended Part; link: https://lcsc.com/eda_search?q=C164041&%26type=1&ref=editor
C45 C46 = CC0402JRNPO9BN200: Supplier: LCSC; Manufacturer: YAGEO; Supplier Part: C107000; JLCPCB Part Class: Extended Part
D5 D6 = TJ-S2005SW9TGLC0A-A5: Supplier: LCSC; Supplier Part: C273620; Manufacturer: TOGIALED; Contributor: LCSC
LEFT-1 = FH34SRJ-16S-0.5SH(50): Supplier: LCSC; Supplier Part: C324725; Manufacturer: Hirose; Contributor: LCSC; JLCPCB Part Class: Extended Part
R61 R63 = RC0402FR-0720RL: Supplier: LCSC; Manufacturer: YAGEO; Supplier Part: C138031; JLCPCB Part Class: Extended Part
R65 R68 = ERJ2RKF5100X: Supplier: LCSC; Supplier Part: C400634; Manufacturer: PANASONIC; Contributor: LCSC
U5 = STM32F103C8T6: Supplier: LCSC; Manufacturer: STMicroelectronics; LCSC Assembly: Yes; image: //image.lceda.cn/szlcsc/C8734.jpg; Supplier Part: C8734; SMT Type: Basic
U6 = CN BOOT-BLUEPILL: Contributor: Marlon Vinicius
X3 = 3225-8.00-10-10-10/A: Supplier: LCSC; Supplier Part: C518154; Manufacturer: Suzhou Liming Elec; Contributor: LCSC; JLCPCB Part Class: Extended Part

## Nets
1.8V: C18.2 C23.1 C24.2 C42.1 IC1.23(ADC_VDD) IC1.60(VCCK_1) IC1.73(VCCK_2) IC1.120(VCCK_3) U3.2(Out) U3.4(TAB)
1V1: C88.2 C89.2 C90.2 U13.23(DVDD) U13.45(VREG_VOUT) U13.50(DVDD)
3.3V CONTROLADORA: C40.1 C43.2 C48.2 C49.2 C53.2 C57.2 C58.2 D5.2 D6.2 L10.1 L11.1 L12.1 L14.1 LEFT-1.1 LEFT-1.2 LEFT-1.3 Q2.1(S) Q2.2(S) Q2.3(S) R29.1 R51.2 R54.1 R64.2 R69.2 R71.2 R77.2 RIGHT-1.6 RIGHT-1.7 U4.2(Vout) U4.4(Vout) U5.9(VDDA) U5.24(VDD_1) U5.36(VDD_2) U5.48(VDD_3) U6.1 U6.2 U7.5(3.5V) VCC.1
3V3: 3V.1 3V3.1 3V3,.1 3V3/.1 C59.2 C62.2 C66.2 C69.2 C70.2 C79.2 C80.2 C84.2 C86.2 C87.2 CARD1.4(VDD) D8.1(K) H1.3 R81.1 U8.8(VDD) U10.8(VCC) U11.5(VOUT) U12.8(VCC) U13.1(IOVDD) U13.10(IOVDD) U13.22(IOVDD) U13.26(RUN) U13.33(IOVDD) U13.42(IOVDD) U13.43(ADC_AVDD) U13.44(VREG_IN) U13.48(USB_VDD) U13.49(IOVDD)
5V: 5V.1 C61.2 C63.1 C74.1 PS2.4 PS2.5 PS2.6 PS2.7 PS2.8 R43.2 R62.1 R73.2 R94.2 R101.1 U3.3(In) U4.3(Vin) U9.10(VDD) U9.15(VDD)
GND: C1.1 C2.2 C9.2 C11.2 C12.2 C15.1 C16.1 C17.1 C18.1 C19.2 C20.1 C21.2 C22.2 C23.2 C24.1 C25.1 C26.2 C27.2 C28.2 C29.2 C30.2 C31.1 C32.1 C36.1 C38.1 C39.1 C40.2 C41.1 C42.2 C43.1 C48.1 C49.1 C50.1 C52.1 C53.1 C54.1 C55.1 C56.1 C57.1 C58.1 C59.1 C60.1 C61.1 C62.1 C63.2 C64.1 C65.1 C66.1 C67.1 C68.2 C69.1 C70.1 C71.2 C72.2 C73.2 C74.2 C75.2 C76.2 C77.2 C78.2 C79.1 C80.1 C82.1 C84.1 C85.2 C86.1 C87.1 C88.1 C89.1 C90.1 C95.1 CARD1.6(VSS) CARD1.10(GND) CARD1.11(GND) CARD1.12(GND) CARD1.13(GND) CN2.1 CONTROL3.2 CONTROL3.13 CONTROL3.14 D4.2(K) FPC1.3 FPC1.13 FPC1.15 FPC1.46 FPC1.51 FPC1.52 FPC2.5 FPC2.15 FPC2.16 FPC6.3 FPC6.29 FPC6.36 FPC6.41 FPC6.42 G1.1 GND.1 GND1.1 GND2.1 GND3.1 GND4.1 GND5.1 GND6.1 GND,.1 H1.4 HDMI1.1 HDMI1.4 HDMI1.10 HDMI1.13 HDMI1.16 HDMI1.19 HDMI1.21 HDMI1.22 IC1.11(GND) IC1.38(ADC_GND/VADC_GND) IC1.61(GNDK) IC1.85(PGND_1) IC1.129(EP) J13.0(SH) J13.1(SH) J13.2(SH) J13.3(SH) J13.A1(GND) J13.A12(GND) J13.B1(GND) J13.B12(GND) J15.2 LEFT-1.4 LEFT-1.17 LEFT-1.18 O1.1 O2.1 O3.1 O4.1 PS2.9 PS2.16 PS2.18 PS2.20 PS2.22 PS2.24 PS2.26 PS2.28 PS2.31 PS2.32 Q1.2(E) Q3.2(E) Q5.2(E) Q6.2(E) R1..1 R3..1 R6.1 R8.1 R15.2 R33.1 R39.2 R42.1 R48.1 R56.1 R58.1 R59.1 R60.2 R65.2 R76.1 R79.1 R80.2 R85.1 R122.1 R236.1 RIGHT-1.8 RIGHT-1.21 RIGHT-1.22 SW1.3 SW1.4 SW2.3 SW2.4 SW3.3 SW3.4 U1.4(GND) U2.2(GND) U3.1(GND) U4.1(GND/ADJ) U5.8(VSSA) U5.23(VSS_1) U5.35(VSS_2) U5.47(VSS_3) U6.5 U6.6 U7.4(GND) U8.4(VSS) U9.5(GND) U9.8(VOLMAX) U9.12(GND) U10.4(VSS) U11.2(GND) U12.4(GND) U13.19(TESTEN) U13.57(GND) X1.2(GND) X1.4(GND) X3.2(GND) X3.4(GND) Y1.2(GND) Y1.4(GND)
VBAT: U5.1(VBAT) VBAT.1
VBUS: C52.2 D9.2(A) J13.A4(VBUS) J13.A9(VBUS) J13.B4(VBUS) J13.B9(VBUS)
1HDMI: HDMI1.20 IC1.8(V8_5) J1.1
3HDMI: HDMI1.18 IC1.7(V8_4) J2.1
4HDMI: HDMI1.17 IC1.6(V8_3) J7.1
6HDMI: HDMI1.15 IC1.5(V8_2) J8.1
7FFC: C55.2 FPC1.7 R87.2
7HDMI: HDMI1.14 IC1.4(V8_1) J3.1
8FFC: C31.2 C32.2 D2.1 D3.1(A) FPC1.8 R86.1
9HDMI: HDMI1.12 IC1.3(V8_0) J4.1
10HDMI: HDMI1.11 IC1.9(V8_6) J9.1
11FFC: FPC1.11 R19.2
12FFC: FPC1.12 R17.2
12HDMI: HDMI1.9 IC1.10(V8_7) J10.1
18HDMI: HDMI1.3 J12.1 R64.1
19HDMI: HDMI1.2 J6.1 R71.1
44FFC: C36.2 C41.2 FPC1.44 FPC6.4 Q2.5(D) Q2.6(D) Q2.7(D) Q2.8(D)
45FFC: C56.2 FPC1.5 FPC1.45 R85.2 R86.2
99: 40P.1 IC1.99(GPIO/PWM3/TCON[11][6]) R17.1 R18.2
102, PWM0: IC1.102(SD3/SPDIF3/TCON[10]/GPIO/PWM0) R47.2
110,WS/GPIO: IC1.110(WS/TCON[6]/GPIO) R53.1 R54.2
111, SD0: IC1.111(SD0/SPDIF0/TCON[4]/GPIO) R89.1 R90.2
123, DDCSDA2: HDMI1.5 J11.1 R49.1
124, DDCSCL2: HDMI1.6 J5.1 R50.1
+: +.1 FPC2.3 R34.2
-: -.1 FPC2.2 R35.2
ACK: ACK.1 CONTROL3.1 U5.29(PA8)
ACKM: CONTROL3.3 U7.8(ACK)
ATT: ATT.1 CONTROL3.7 U5.25(PB12)
ATTM: CONTROL3.5 U7.6(ATT)
BO: B.1 L9.2 PS2.25
BOOT0: R66.1 U5.44(BOOT0)
BOOT1: R67.2 U5.20(PB2)
button: LEFT-1.5 PS2.13
Circle: CIRCLE.1 RIGHT-1.13 U5.46(PB9)
CLK: CLK.1 CONTROL3.6 U5.26(PB13)
CLKM: CONTROL3.4 U7.7(CLK)
CMDM: CONTROL3.9 U7.2(CMD)
CO: AV1.1 L1..2 PS2.27
COMM: COM.1 CONTROL3.11 U5.28(PB15)
Cross: CROSS.1 RIGHT-1.12 U5.45(PB8)
CS: R11.1 U1.1(CS#)
D+: J13.A6(DP1) J13.B6(DP2) R96.2
D-: J13.A7(DN1) J13.B7(DN2) R93.2
DAT: CONTROL3.12 DAT.1 U5.27(PB14)
DATM: CONTROL3.10 U7.1(DAT)
DISP: FPC6.31 R78.1
Down: DOWN.1 LEFT-1.14 U5.14(PA4)
FPC37, DCLK: FPC1.14 FPC6.30 IC1.96(DCLK/GPIO/PWM0)
FPC 1,2: C30.1 C85.1 D1.1 FPC1.49 FPC1.50 FPC6.2 U2.5(OV)
FPC 3,4: FPC1.47 FPC1.48 FPC6.1 R33.2 R41.2
FPC 9, DENA: FPC1.42 FPC6.34 IC1.94(DENA/TXE0+)
FPC 10, DVS: FPC1.41 IC1.97(DVS/GPIO/PWM1) VS.1
FPC 11, DHS: FPC1.40 HS.1 IC1.95(DHS/TXE0-)
FPC 12, ARED0: FPC1.39 FPC6.5 IC1.93(ARED0/ARED2_/TXE1-)
FPC 13, ARED1: FPC1.38 FPC6.6 IC1.92(ARED1/ARED3_/TXE1+)
FPC 14, ARED2: FPC1.37 FPC6.7 IC1.91(ARED2/ARED4_/_TXE2-)
FPC 15, ARED3: FPC1.36 FPC6.8 IC1.90(ARED3/ARED5_/_TXE2+)
FPC 16, ARED4: FPC1.35 FPC6.9 IC1.89(ARED4/ARED6_/TXEC-)
FPC 17, ARED5: FPC1.34 FPC6.10 IC1.88(ARED5/ARED7_/TXEC+)
FPC 18, ARED6: FPC1.33 FPC6.11 IC1.87(ARED6/AGRN2_/TXE3-)
FPC 19, ARED7: FPC1.32 FPC6.12 IC1.86(ARED7/AGRN3_/TXE3+)
FPC 20, AGRN0: FPC1.31 FPC6.13 IC1.83(AGRN0/GPIO/AGRN4/TXO0-)
FPC 21, AGRN1: FPC1.30 FPC6.14 IC1.82(AGRN1/GPIO/AGRN5_/TXO0+)
FPC 22, AGRN2: FPC1.29 FPC6.15 IC1.81(AGRN2/GPIO/AGRN6/TXO1-)
FPC 23, AGRN3: FPC1.28 FPC6.16 IC1.80(AGRN3/GPIO/AGRN7_/TXO1+)
FPC 24, AGRN4: FPC1.27 FPC6.17 IC1.79(AGRN4/GPIO/ABLU2_/TXO2-)
FPC 25, AGRN5: FPC1.26 FPC6.18 IC1.78(AGRN5/GPIO/ABLU3_/TXO2+)
FPC 26, AGRN6: FPC1.25 FPC6.19 IC1.77(AGRN6/GPIO/ABLU4/_TXOC-)
FPC 27, AGRN7: FPC1.24 FPC6.20 IC1.76(AGRN7/GPIO/ABLU5_/_TXOC+)
FPC 28, ABLU0: FPC1.23 FPC6.21 IC1.75(ABLU0/GPIO/ABLU6_/_TXO3-)
FPC 29, ABLU1: FPC1.22 FPC6.22 IC1.74(ABLU1/GPIO/ABLU7/TXO3+)
FPC 30, ABLU2: FPC1.21 FPC6.23 IC1.71(ABLU2/SPDIF3/SD3/TCON[10][8]/GPIO/PWM1/PWM5)
FPC 31, ABLU3: FPC1.20 FPC6.24 IC1.70(ABLU3/SPDIF2/SD2/TCON[9][11]/GPIO/IICSDA)
FPC 32, ABLU4: FPC1.19 FPC6.25 IC1.69(ABLU4/SPDIF1/SD1/TCON[7][3]/GPIO/IICSCL)
FPC 33, ABLU5: FPC1.18 FPC6.26 IC1.68(ABLU5/SD0/SPDIF0/TCON[13][3]/GPIO)
FPC 34, ABLU6: FPC1.17 FPC6.27 IC1.67(ABLU6/MCK/TCON[5][9]/GPIO)
FPC 35, ABLU7: FPC1.16 FPC6.28 IC1.66(ABLU7/SCK/TCON[4][2]/GPIO)
FPC 41: C12.1 FPC1.10 R84.2
FPC 42: C15.2 FPC1.9 R83.2
GO: G.1 L4.2 PS2.23
Home: HOME.1 RIGHT-1.14 U5.3(PC14-OSC32_IN)
HSYNC: HS1.1 PS2.2 R57.1 R58.2
L: C81.2 L-IN1.1 PS2.17
L1: L/1.1 LEFT-1.8 U5.38(PA15)
L2: L/2.1 LEFT-1.9 U5.31(PA10)
L3: L/3.1 LEFT-1.10 U5.30(PA9)
L+: C47.1 C73.1 L100.2 L+.1
LB: FPC2.11 PS2.10 RIGHT-1.5
Left: LEFT.1 LEFT-1.13 U5.15(PA5)
LG: FPC2.10 PS2.11 RIGHT-1.4
LR: FPC2.9 PS2.12 RIGHT-1.3
LX: LEFT-1.16 LX.1 U5.11(PA1)
LY: LEFT-1.15 LY.1 U5.12(PA2)
MENU: FPC2.4 MN.1 R26.2
OLED_SCL: H1.2 U13.37(GPIO25)
OLED_SDA: H1.1 U13.40(GPIO28_ADC2)
OSCIN: C46.2 R70.1 U5.5(PD0-OSC_IN) X3.1
OSCOUT: C45.2 R70.2 U5.6(PD1-OSC_OUT) X3.3
PA0: RIGHT-1.19 RY.1 U5.10(PA0-WKUP)
PA3: RIGHT-1.20 RX.1 U5.13(PA3)
PA6: LEFT-1.12 RIGHT.1 U5.16(PA6)
PA7: LEFT-1.11 U5.17(PA7) UP.1
PA11: PA11.1 R61.2 U5.32(PA11)
PA12: PA12.1 R62.2 R63.2 U5.33(PA12)
PB0: R/2.1 RIGHT-1.16 U5.18(PB0)
PB1: R/1.1 RIGHT-1.18 U5.19(PB1)
PB3: C28.1 IC1.64(SD0/SPDIF0/TCON[0]/GPIO/IRDA) IR.1 PB3.1 R38.1 R72.1 U5.39(PB3)
PB4: RIGHT-1.10 TRIANGLE.1 U5.40(PB4)
PB5: RIGHT-1.11 SQUARE.1 U5.41(PB5)
PB6: PB6.1 U5.42(PB6)
PB7: PB7.1 U5.43(PB7)
PB10: R/3.1 RIGHT-1.17 U5.21(PB10)
PB11: PB11.1 U5.22(PB11)
PC13: LEFT-1.7 R68.2 RIGHT-1.9 SELECT.1 U5.2(PC13-TAMPER-RTC)
PC15: LEFT-1.6 RIGHT-1.15 START.1 U5.4(PC15-OSC32_OUT)
PSM: CONTROL3.8 U7.3(8.5V)
PSRAM_CLK: U8.6(SCLK) U10.6(SCLK) U13.5(GPIO3)
PSRAM_CS: U8.1(#CE) U10.1(CE#) U13.4(GPIO2)
PSRAM_IO0: U8.5(SI/SIO0) U10.5(SI/SIO[0]) U13.6(GPIO4)
PSRAM_IO1: U8.2(SO/SIO1) U10.2(SO/SIO[1]) U13.7(GPIO5)
PSRAM_IO2: U8.3(SIO2) U10.3(SIO[2]) U13.8(GPIO6)
PSRAM_IO3: U8.7(SIO3) U10.7(SIO[3]) U13.9(GPIO7)
PSX_3.5V: 3.5V.1 C54.2 D8.2(A)
PSX_7.5V: 8.5V.1
PSX_ACK: ACK1.1 R100.2
PSX_CLK: CLK1.1 R74.2
PSX_CMD: CMD1.1 R99.2
PSX_DAT: DAT1.1 R97.2
PSX_SEL: ATT1.1 R75.2
PWM5: IC1.101(GPIO/PWM5/TCON[0]) Q1.3(C) R38.2
QSPI_SCLK: U12.6(CLK) U13.52(QSPI_SCLK)
QSPI_SD0: U12.5(DI(IO0)) U13.53(QSPI_SD0)
QSPI_SD1: U12.2(DO(IO1)) U13.55(QSPI_SD1)
QSPI_SD2: U12.3(WP#(IO2)) U13.54(QSPI_SD2)
QSPI_SD3: U12.7(HOLD#orRESET#(IO3)) U13.51(QSPI_SD3)
QSPI_SS: R91.2 SW3,.1 SW3/.1 U12.1(CS#) U13.56(QSPI_SS)
R: C83.2 PS2.19 R-IN1.1
R+: C44.1 C72.1 L90.2 R+.1
RESET: C50.2 R69.1 RESET.1 U5.7(NRST)
RESET-RT: FPC2.8 PS2.3
RO: L3..2 PS2.21 R.1
SCL.: R24.2 SCL.1
SCLK: R14.1 U1.6(CLK)
SD_CLK: CARD1.5(CLK) U13.38(GPIO26_ADC0)
SD_CS: CARD1.2(CD/DAT3) U13.41(GPIO29_ADC3)
SD_MISO: CARD1.7(DAT0) R81.2 U13.36(GPIO24)
SD_MOSI: CARD1.3(CMD) U13.39(GPIO27_ADC1)
SDA.: R23.2 SDA.1
SE/BTL#: CN2.4 R94.1 R95.2
SI: R13.1 U1.5(DI)
SO: R12.1 U1.2(DO)
SOURCE: FPC2.1 R36.1 SC.1
SW1: SW1.1 SW1.2 SW1,.1 SW1/.1 U13.32(GPIO21)
SW2: SW2.1 SW2.2 SW2,.1 SW2/.1 U13.35(GPIO23)
SWCLK: C51.1 U13.24(SWCLK)
SWDCLK: SWCLK.1 U5.37(SWDCLK)
SWDIO: D7.1 SWIO.1 U5.34(PA13) U13.25(SWD)
UART_RX: RX1.1 U13.12(GPIO9)
UART_TX: TX1.1 U13.11(GPIO8)
VOL: C76.1 C77.1 R98.1 U9.7(VOLUME)
vol+: FPC2.7 PS2.14
vol-: FPC2.6 PS2.15
VOL_PWM: IC1.55(BADC0/PWM1/PWM5/GPIO) R364.1
VSYNC: PS2.1 R55.1 R56.2 VS1.1
VSYS: FPC2.12 FPC2.13 PS2.29 PS2.30 RIGHT-1.1 RIGHT-1.2
XIN: C68.1 U13.20(XIN) Y1.3(OSC2)
XOUT: R92.1 U13.21(XOUT)
Net-(40P-2): 40P.2 R78.2 R79.2
Net-(C1-2): C1.2 L4.1 R4.1 R5.1 R6.2
Net-(C2-1): C2.1 L3..1 R1..2 R2..1
Net-(C3-1): C3.1 R2..2
Net-(C3-2): C3.2 IC1.30(R0+)
Net-(C4-1): C4.1 R3..2
Net-(C4-2): C4.2 IC1.29(R0-)
Net-(C5-1): C5.1 R4.2
Net-(C5-2): C5.2 IC1.28(SOG0)
Net-(C6-1): C6.1 R5.2
Net-(C6-2): C6.2 IC1.27(G0+)
Net-(C7-1): C7.1 R8.2
Net-(C7-2): C7.2 IC1.26(G0-)
Net-(C8-1): C8.1 R7.2
Net-(C8-2): C8.2 IC1.25(B0+)
Net-(C9-1): C9.1 L9.1 R7.1 R60.1
Net-(C10-1): C10.1 R59.2
Net-(C10-2): C10.2 IC1.24(B0-)
Net-(C11-1): C11.1 IC1.128(XI) R52.2 X1.3(OSC2)
Net-(C13-1): C13.1 C14.2 D1.2 D2.2 L22.2 U2.1(SW)
Net-(C13-2): C13.2 D3.3(COM)
Net-(C14-1): C14.1 D4.3(COM)
Net-(C16-2): C16.2 C19.1 C20.2 C21.1 C22.1 IC1.1(VDD) IC1.20(VDD_2) IC1.49(VADC_VDD) IC1.62(PVCC_1) IC1.84(PVCC_2) IC1.106(PVCC_3) L12.2 R16.1 R72.2
Net-(C17-2): C17.2 C25.2 C82.2 L11.2 R9.1 R10.1 R18.1 R20.1 R25.1 R27.1 R28.1 R30.1 R31.1 R32.2 R82.1 R87.1 U1.7(HOLD#) U1.8(VCC)
Net-(C26-1): C26.1 IC1.50(A-ADC0/AVOUT/VCLK/GPIO) R43.1 R48.2
Net-(C27-1): C27.1 PW.1 R26.1 R32.1 R34.1 R35.1 R36.2 R37.2
Net-(C29-1): C29.1 R40.1 VCC1.1
Net-(C33-1): C33.1 IC1.44(V8_4/VIN-1)
Net-(C33-2): C33.2 C34.2 C37.2 R42.2 R45.1
Net-(C34-1): C34.1 C35.2 L2..1
Net-(C35-1): C35.1 IC1.43(V8_5/VIN+1)
Net-(C37-1): C37.1 L2..2 R46.1
Net-(C38-2): C38.2 R44.2 R47.1
Net-(C39-2): C39.2 IC1.127(XO) R52.1 X1.1(OSC1)
Net-(C44-2): C44.2 CN2.3 R122.2
Net-(C45-1): C45.1 C46.1
Net-(C47-2): C47.2 CN2.2 R236.2
Net-(C60-2): C60.2 U11.4(NC)
Net-(C64-2): C64.2 C65.2 C95.2 D9.1(K) U11.1(VIN) U11.3(EN)
Net-(C67-2): C67.2 R92.2 Y1.1(OSC1)
Net-(C71-1): C71.1 L80.2 R-.1
Net-(C75-1): C75.1 L110.2 L-.1
Net-(C78-1): C78.1 U9.4(BYPASS)
Net-(C81-1): C81.1 U9.6(LIN-)
Net-(C83-1): C83.1 U9.3(RIN-)
Net-(D3-2): D3.2(K) R84.1
Net-(D4-1): D4.1(A) R83.1
Net-(D5-1): D5.1 R68.1
Net-(D6-1): D6.1 R65.1
Net-(D+1-1): D+1.1 D+,1.1 R96.1 U13.47(USB_DP)
Net-(D+-1): D+.1 R63.1
Net-(D-1-1): D-1.1 D-,1.1 R93.1 U13.46(USB_DM)
Net-(D--1): D-.1 R61.1
Net-(FPC1-4): FPC1.4 J15.1 R77.1
Net-(FPC6-32): FPC6.32 HS.2
Net-(FPC6-33): FPC6.33 VS.2
Net-(IC1-2): IC1.2(NC_1) R16.2
Net-(IC1-21): IC1.21(AVS0) R55.2
Net-(IC1-22): IC1.22(AHS0) R57.2
Net-(IC1-52): IC1.52(A-ADC2/GPIO) R22.1
Net-(IC1-53): IC1.53(A-ADC3/GPIO) R37.1
Net-(IC1-56): IC1.56(B-ADC1/IICSCL/GPIO) R31.2
Net-(IC1-57): IC1.57(B-ADC2/IICSDA/GPIO) R30.2
Net-(IC1-58): IC1.58(DDCSCL1/GPIO) R10.2 R24.1
Net-(IC1-59): IC1.59(DDCSDA1/GPIO) R23.1 R28.2
Net-(IC1-65): IC1.65(WS/TCON[7][1]/GPIO/PWM1) R21.1
Net-(IC1-98): IC1.98(GPIO/PWM2) R19.1 R20.2
Net-(IC1-115): IC1.115(SPI_SCLK/SDIO) R14.2
Net-(IC1-116): IC1.116(SI/MCU_SCLK) R13.2
Net-(IC1-117): IC1.117(SO/SCSB) R12.2
Net-(IC1-118): IC1.118(CEB/IRQB) R11.2 R15.1
Net-(IC1-123): IC1.123(DDCSDA2/GPIO) R49.2
Net-(IC1-124): IC1.124(DDCSCL2/GPIO) R50.2
Net-(IC1-125): IC1.125(RESETB) R51.1
Net-(IR-V-1): IR-V.1 R27.2
Net-(J13-A5): J13.A5(CC1) R80.1
Net-(J13-B5): J13.B5(CC2) R76.2
Net-(L1.-1): L1..1 R45.2 R46.2
Net-(L10-2): L10.2 R88.2 R89.2
Net-(L14-2): L14.2 L22.1 U2.6(IN)
Net-(L80-1): L80.1 U9.16(ROUT-)
Net-(L90-1): L90.1 U9.14(ROUT+)
Net-(L100-1): L100.1 U9.11(LOUT+)
Net-(L110-1): L110.1 U9.9(LOUT-)
Net-(LG-1): LG.1 R21.2 R25.2
Net-(LR-1): LR.1 R9.2 R22.2
Net-(Q1-1): Q1.1(B) R39.1 R40.2
Net-(Q2-4): Q2.4(G) Q3.3(C) R29.2
Net-(Q3-1): Q3.1(B) R53.2
Net-(Q5-1): Q5.1(B) R90.1
Net-(Q5-3): Q5.3(C) R88.1 U2.4(EN)
Net-(Q6-1): Q6.1(B) R364.2
Net-(Q6-3): Q6.3(C) R73.1 R98.2
Net-(R41-1): R41.1 R44.1 U2.3(FB)
Net-(R66-2): R66.2 U6.3
Net-(R67-1): R67.1 U6.4
Net-(R74-1): R74.1 U13.29(GPIO18)
Net-(R75-1): R75.1 U13.28(GPIO17)
Net-(R82-2): R82.2 U1.3(WP#)
Net-(R91-1): R91.1 SW3.1 SW3.2
Net-(R95-1): R95.1 U9.13(SE/BTL#)
Net-(R97-1): R97.1 U13.31(GPIO20)
Net-(R99-1): R99.1 U13.30(GPIO19)
Net-(R100-1): R100.1 U13.27(GPIO16)
Net-(R101-2): R101.2 U9.2(SD#)

Not connected (* = marked no-connect by the designer): CARD1 1(DAT2)* 8(DAT1)* 9(CD)*; FPC1 1* 2* 6* 43*; FPC2 14*; FPC6 35* 37* 38* 39* 40*; HDMI1 7* 8*; IC1 12(NC_2)* 13(NC_3)* 14(NC_4)* 15(NC_5)* 16(NC_6)* 17(NC_7)* 18(NC_8)* 19(NC_9)* 31(V8_7/B1-)* 32(V8_6/B1+)* 33(V8_5/G1-)* 34(V8_4/G1+)* 35(V8_3/SOG1)* 36(V8_2/R1-)* 37(V8_1/R1+)* 39(V8_0/AHS1)* 40(VCLK/AVS1)* 41(V8_7/VIN+0)* 42(V8_6/VIN-0)* 45(V8_3/VIN+2)* 46(V8_2/VIN-2)* 47(V8_1/VIN+3)* 48(V8_0/VIN-3)* 51(A-ADC1/GPIO)* 54(A-ADC4/GPIO)* 63(NC_10)* 72(NC_11)* 100(GPIO/PWM4/TCON[12][3])* 103(SD2/SPDIF2/TCON[8]/GPIO/IICSCL/PWM1)* 104(SD1/SPDIF1/TCON[5]/GPIO/IRQB/IICSDA)* 105(SD0/SPDIF0/TCON[9]/GPIO)* 107(PGND_2)* 108(MCK/TCON[7]/GPIO)* 109(SCK/TCON[3]/GPIO)* 112(SD1/SPDIF1/TCON[9]/GPIO)* 113(SD2/SPDIF2/TCON[1]/GPIO/IRDA)* 114(SD3/SPDIF3/TCON[13]/GPIO/VCLK)* 119(NC_12)* 121(DDCSCL3/GPIO)* 122(DDCSDA3/GPIO)* 126(CEC)*; J13 A8(SBU1)* B8(SBU2)*; U9 1(MUTE)*; U12 9(EP)*; U13 2(GPIO0)* 3(GPIO1)* 13(GPIO10)* 14(GPIO11)* 15(GPIO12)* 16(GPIO13)* 17(GPIO14)* 18(GPIO15)* 34(GPIO22)*

## Notes on the sheets
sheet 1
- BOOTx
  Settings
- LED
  D2 Programmable
- RESET
  Circuit
- External Terminal
- MCU
- J-Link OB
  INTERFACE
sheet 2
- LR = LED RED
- LG = LED GREEN
- SC = SOURCE
- MN = MENU
- PW = POWER
- IR-VOC
- CONFERIDO E ESTA CORRETO
- DAT
- CMD
- DATM
- CMDM
- PSM
- ATT
- CLK
- ATTM
- CLKM
- ACKM
- NC
- ACK
sheet 3
- 3
- 1
- 2
sheet 4
- Certifique-se de que C8 esteja
- próximo ao pino 45 do RP204
- Certifique-se de que C10 esteja
- próximo em 44 de RP204
